# Altium project QUTMS-RADIO-COMPUTE-V00.PrjPcb
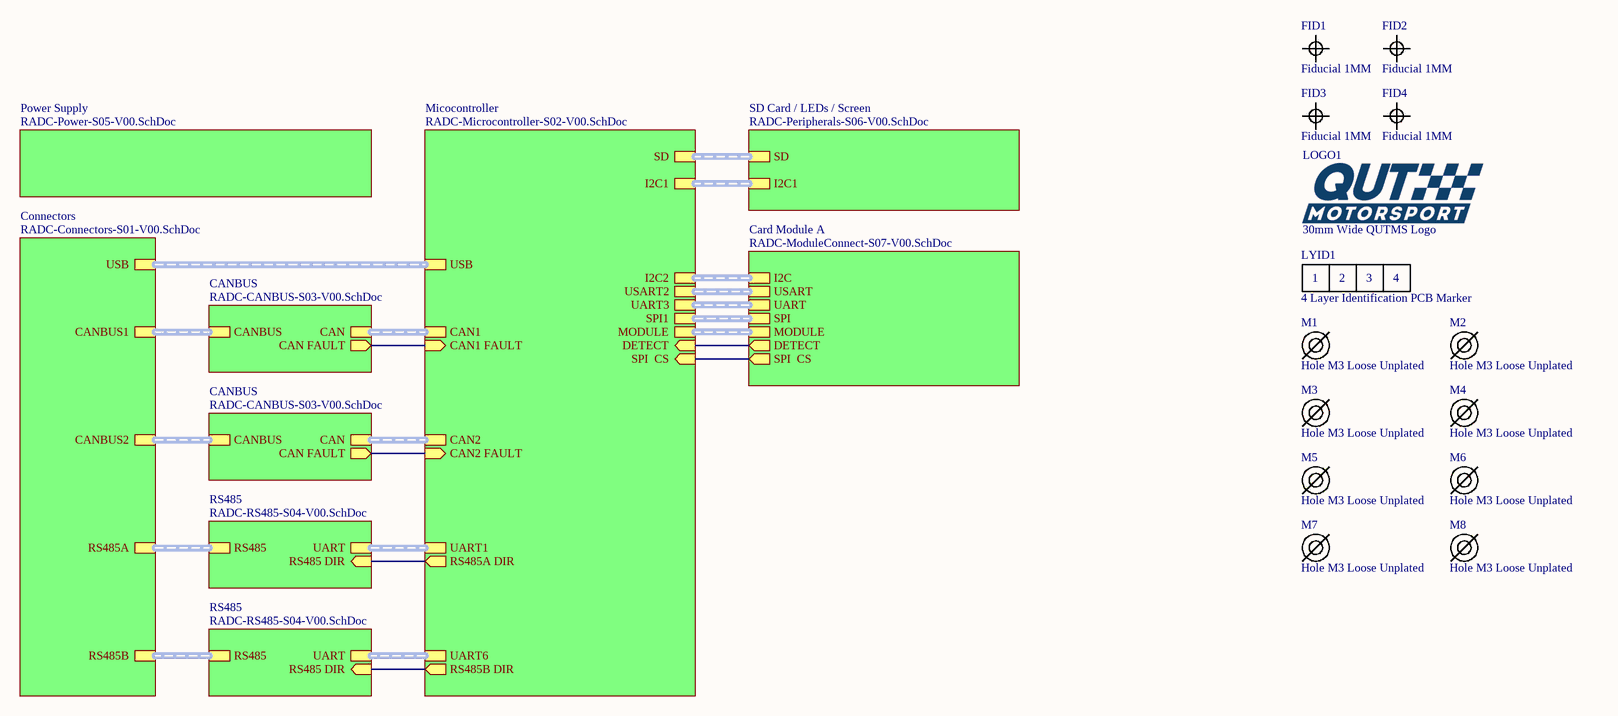
[diagram p0: RADC-Master-S00-V00.SchDoc]
8 sheets, 167 parts. Net scope: hierarchical (ports join the sheet entries above them; power ports are global).
Board file: RADC-B00-V00.PcbDoc
Sheets:
  RADC-Master-S00-V00.SchDoc
    Connectors = RADC-Connectors-S01-V00.SchDoc
    Power Supply = RADC-Power-S05-V00.SchDoc
    Micocontroller = RADC-Microcontroller-S02-V00.SchDoc
    SD Card / LEDs / Screen = RADC-Peripherals-S06-V00.SchDoc
    CANBUS = RADC-CANBUS-S03-V00.SchDoc
    CANBUS = RADC-CANBUS-S03-V00.SchDoc
    Card Module A = RADC-ModuleConnect-S07-V00.SchDoc
    RS485 = RADC-RS485-S04-V00.SchDoc
    RS485 = RADC-RS485-S04-V00.SchDoc

## Sheet RADC-Master-S00-V00.SchDoc: RADC Master (Top Level)
size A3; DrawnBy: Jonn Dillon; DocumentNumber: 1; SheetNumber: 1; SheetTotal: 8; Version: 00; Project: QUTMS RADIO COMPUTE; PageSetup: Record=PageOptions|CenterHorizontal=True|CenterVertical=True|PrintScale=0.97|XCorrection=1.00|YCorrection=1.00|PrintKind=0|BorderSize=5000000|LeftOffset=0|BottomOffset=0|Orientation=2|PaperLength=1000|PaperWidth=1000|Scale=100|PaperSource=7|PrintQuality=-4|MediaType=1|DitherType=10|PaperKind=A4|PrintScaleMode=1

### Parts
FID1  Fiducial 1MM  [FIDUCIAL 1MM]  (no BOM)
FID2  Fiducial 1MM  [FIDUCIAL 1MM]  (no BOM)
FID3  Fiducial 1MM  [FIDUCIAL 1MM]  (no BOM)
FID4  Fiducial 1MM  [FIDUCIAL 1MM]  (no BOM)
LOGO1  30mm Wide QUTMS Logo  [QUTMS LOGO 30MM]  (no BOM)
LYID1  4 Layer Identification PCB Marker  [LAYER IDENT 4]  (no BOM)
M1  Hole M3 Loose Unplated  [M3.5 UNPLATED]  (no BOM)
M2  Hole M3 Loose Unplated  [M3.5 UNPLATED]  (no BOM)
M3  Hole M3 Loose Unplated  [M3.5 UNPLATED]  (no BOM)
M4  Hole M3 Loose Unplated  [M3.5 UNPLATED]  (no BOM)
M5  Hole M3 Loose Unplated  [M3.5 UNPLATED]  (no BOM)
M6  Hole M3 Loose Unplated  [M3.5 UNPLATED]  (no BOM)
M7  Hole M3 Loose Unplated  [M3.5 UNPLATED]  (no BOM)
M8  Hole M3 Loose Unplated  [M3.5 UNPLATED]  (no BOM)

### Sub-sheets
CANBUS = RADC-CANBUS-S03-V00.SchDoc: CAN (harness CAN), CANBUS (harness CANBUS), CAN FAULT (out)
CANBUS = RADC-CANBUS-S03-V00.SchDoc: CAN (harness CAN), CANBUS (harness CANBUS), CAN FAULT (out)
Card Module A = RADC-ModuleConnect-S07-V00.SchDoc: I2C (harness I2C), USART (harness USART), UART (harness UART), SPI (harness SPI), MODULE (harness MODULE), DETECT (out), SPI  CS (out)
Connectors = RADC-Connectors-S01-V00.SchDoc: USB (harness USB), CANBUS2 (harness CANBUS), CANBUS1 (harness CANBUS), RS485A (harness RS485), RS485B (harness RS485)
Micocontroller = RADC-Microcontroller-S02-V00.SchDoc: USB, SD, CAN1, CAN2, I2C2 (harness I2C), USART2 (harness USART), SPI1 (harness SPI), MODULE, UART1, UART3 (harness UART), UART6 (harness UART), DETECT (in), RS485A DIR (out), RS485B DIR (out), SPI  CS (in), CAN1 FAULT (in), CAN2 FAULT (in), I2C1 (harness I2C)
Power Supply = RADC-Power-S05-V00.SchDoc: no entries
RS485 = RADC-RS485-S04-V00.SchDoc: RS485 DIR (in), RS485 (harness RS485), UART (harness UART)
RS485 = RADC-RS485-S04-V00.SchDoc: RS485 DIR (in), RS485 (harness RS485), UART (harness UART)
SD Card / LEDs / Screen = RADC-Peripherals-S06-V00.SchDoc: SD (harness SD), I2C1 (harness I2C)

### Nets
CAN FAULT: sheet Micocontroller/CAN1 FAULT, sheet Micocontroller/CAN2 FAULT, sheet CANBUS/CAN FAULT, sheet CANBUS/CAN FAULT
DETECT: sheet Micocontroller/DETECT, sheet Card Module A/DETECT
RS485A DIR: sheet Micocontroller/RS485A DIR, sheet RS485/RS485 DIR
RS485B DIR: sheet Micocontroller/RS485B DIR, sheet RS485/RS485 DIR
SPI CS: sheet Micocontroller/SPI  CS, sheet Card Module A/SPI  CS

### Buses and harness runs
harness sheet CANBUS/CAN = sheet Micocontroller/CAN1
harness sheet CANBUS/CAN = sheet Micocontroller/CAN2
harness sheet CANBUS/CANBUS = sheet Connectors/CANBUS1
harness sheet CANBUS/CANBUS = sheet Connectors/CANBUS2
harness sheet Card Module A/I2C = sheet Micocontroller/I2C2
harness sheet Card Module A/MODULE = sheet Micocontroller/MODULE
harness sheet Card Module A/SPI = sheet Micocontroller/SPI1
harness sheet Card Module A/UART = sheet Micocontroller/UART3
harness sheet Card Module A/USART = sheet Micocontroller/USART2
harness sheet Connectors/RS485A = sheet RS485/RS485
harness sheet Connectors/RS485B = sheet RS485/RS485
harness sheet Connectors/USB = sheet Micocontroller/USB
harness sheet Micocontroller/I2C1 = sheet SD Card / LEDs / Screen/I2C1
harness sheet Micocontroller/SD = sheet SD Card / LEDs / Screen/SD
harness sheet Micocontroller/UART1 = sheet RS485/UART
harness sheet Micocontroller/UART6 = sheet RS485/UART

### Notes on the sheet
- Revision History:
- Sheet Title:
- Rev
- Date
- Description
- Project:
- Size:
- Drawn By:
- A3
- Number:
- Revision:
- Sheet
- Version:
- of
- QUT Motorsport
- O-120, Gardens Point
- 2 George Street
- Brisbane, QLD 4000
- Australia
- Print Date:
- Print Time:
- File Name:
- (in symbol Layer Identification 4) 1; 2; 3; 4

### Library data of the parts
LOGO1 = QUTMS Logo 30mm
LYID1 = Layer Identification 4
M1-M8 = Hole M3 Loose Unplated: M3.5 Hole, No Plating

## Sheet RADC-Connectors-S01-V00.SchDoc: RADC Connectors (2x MX120G, Dual CANBUS, USB Header)
size A3; DrawnBy: Jonn Dillon; DocumentNumber: 2; SheetNumber: 2; SheetTotal: 8; Version: 00; Project: QUTMS RADIO COMPUTE; PageSetup: Record=PageOptions|CenterHorizontal=True|CenterVertical=True|PrintScale=0.97|XCorrection=1.00|YCorrection=1.00|PrintKind=0|BorderSize=5000000|LeftOffset=0|BottomOffset=0|Orientation=2|PaperLength=1000|PaperWidth=1000|Scale=100|PaperSource=7|PrintQuality=-4|MediaType=1|DitherType=10|PaperKind=A4|PrintScaleMode=1
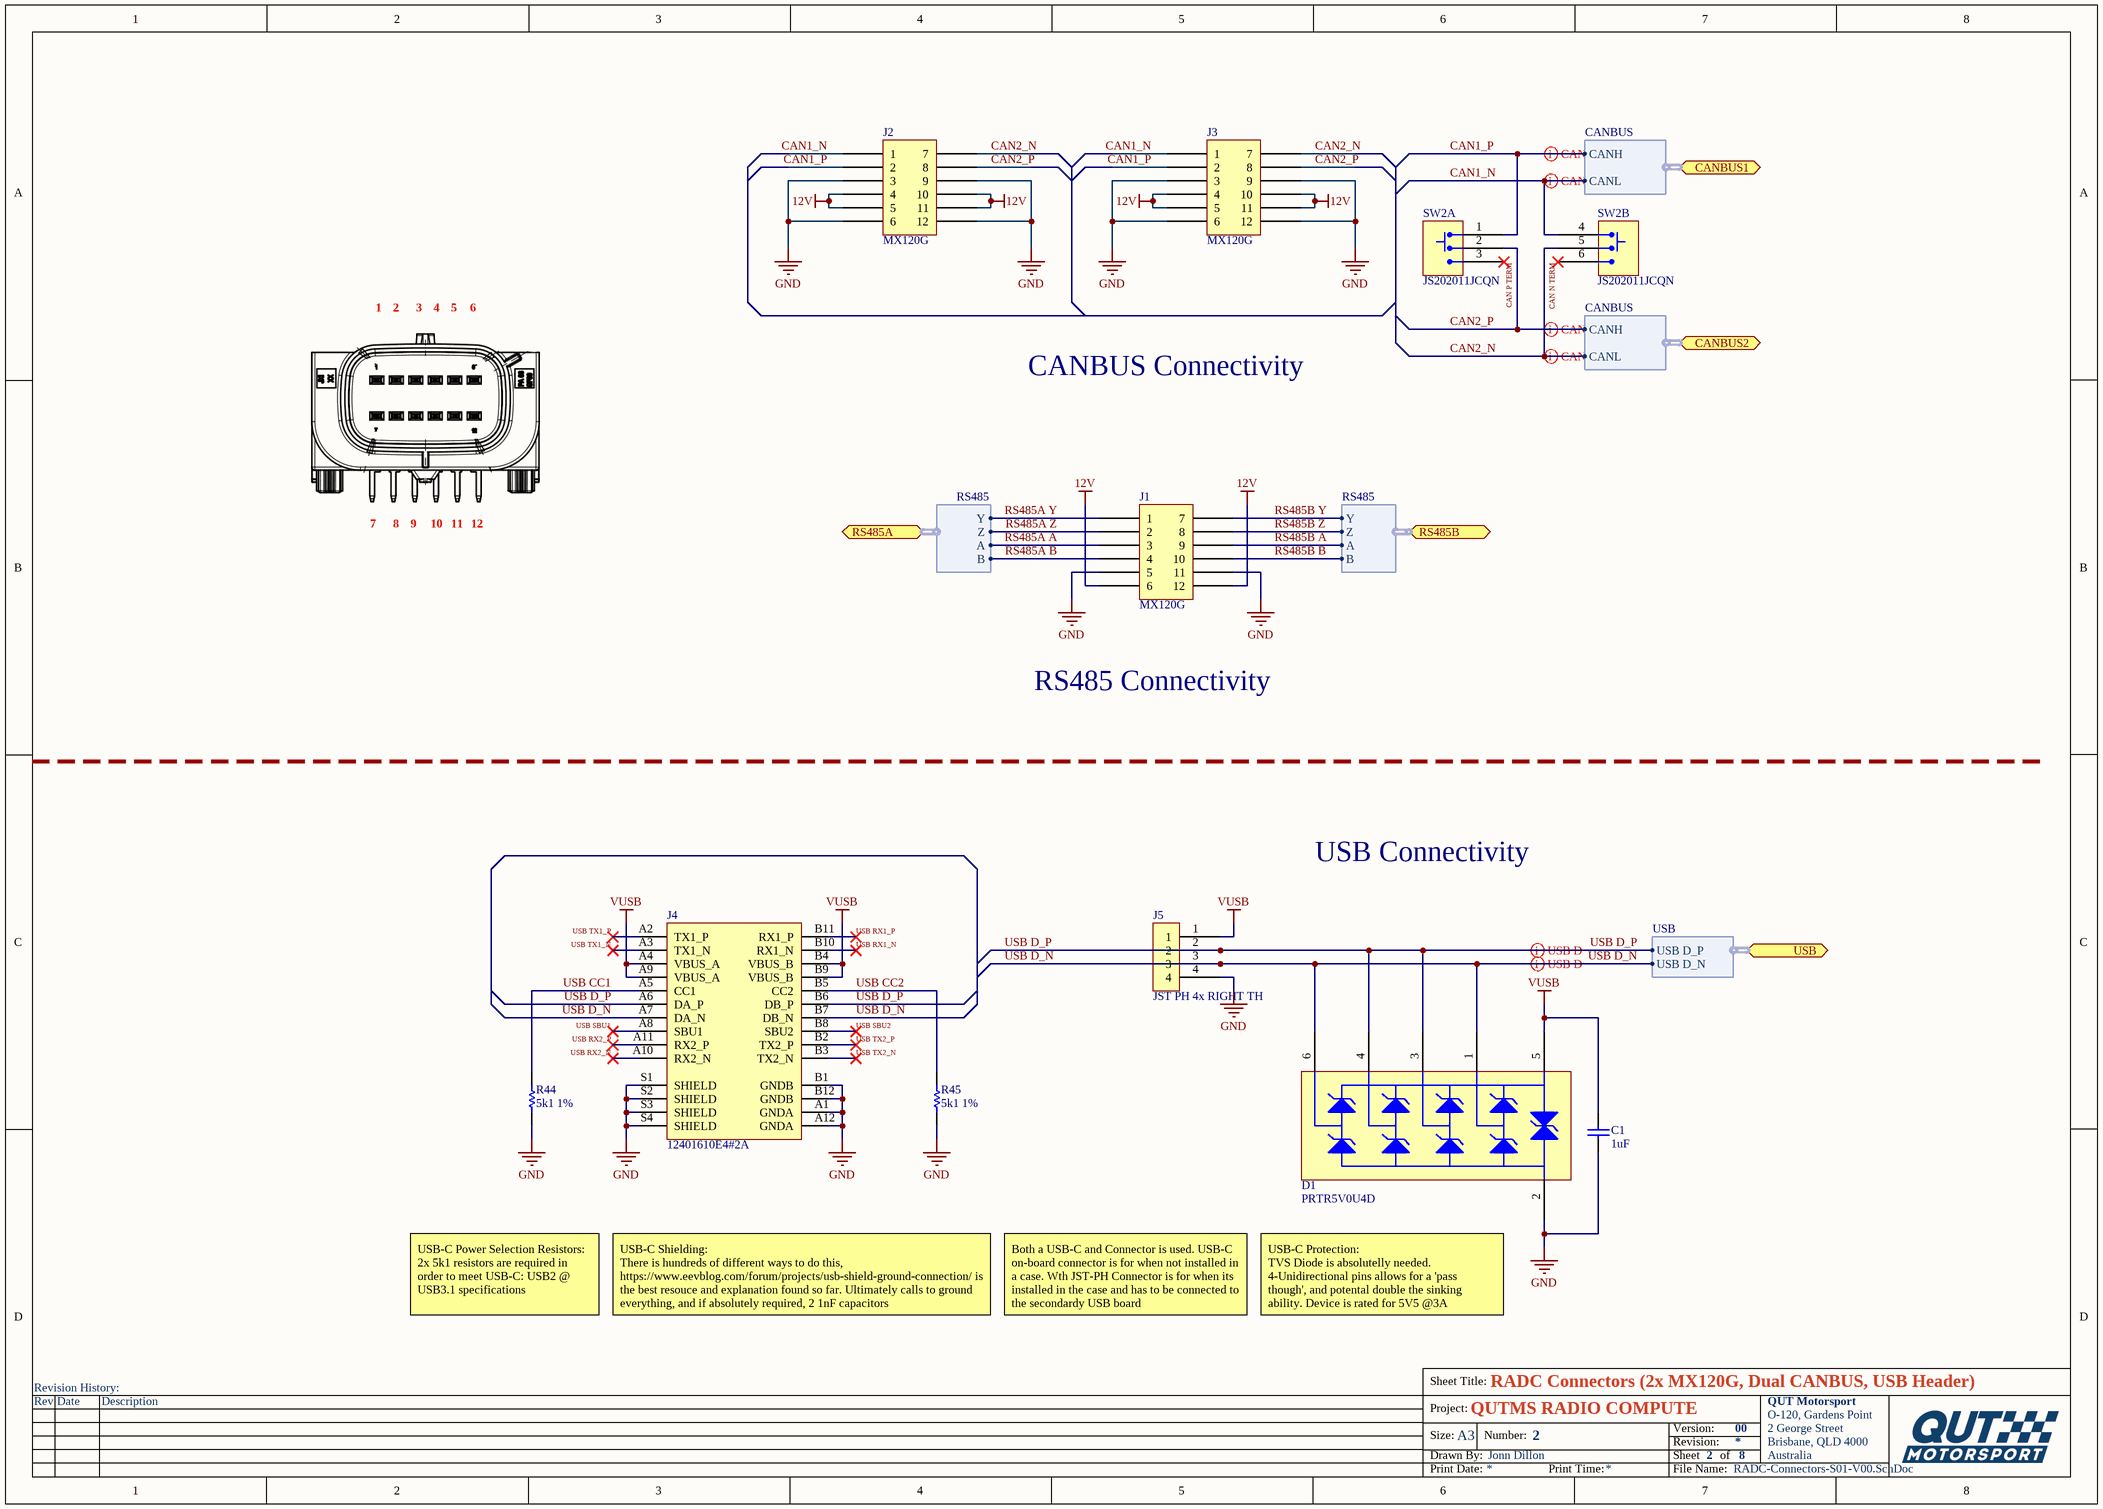
[diagram p1: RADC-Connectors-S01-V00.SchDoc]

### Parts
C1  1uF  [Cap_Ceramic_0603]
D1  PRTR5V0U4D  [SC-47]
J1  MX120G  [MX120G]
J2  MX120G  [MX120G]
J3  MX120G  [MX120G]
J4  12401610E4#2A  [12401610E4#2A]
J5  JST PH 4x RIGHT TH  [JST PH 4x RIGHT TH]
R44  5k1 1%  [Res_ThinFilm_0603]
R45  5k1 1%  [Res_ThinFilm_0603]
SW2  JS202011JCQN  [JS202011JCQN]  (parts A,B of 2)

### Ports
CANBUS1 (bidir, harness CANBUS), CANBUS2 (bidir, harness CANBUS), RS485A (bidir, harness RS485), RS485B (bidir, harness RS485), USB (bidir, harness USB)

### Harnesses
USB: USB D_P, USB D_N
RS485: Y, Z, A, B
CANBUS: CANH, CANL

### Nets
12V: J1.6 J1.12 J2.4 J2.5 J2.10 J2.11 J3.4 J3.5 J3.10 J3.11
GND: C1.1 D1.2(GND) J1.5 J1.11 J2.3 J2.6 J2.9 J2.12 J3.3 J3.6 J3.9 J3.12 J4.A1(GNDA) J4.A12(GNDA) J4.B1(GNDB) J4.B12(GNDB) J4.S1(SHIELD) J4.S2(SHIELD) J4.S3(SHIELD) J4.S4(SHIELD) J5.4 R44.1 R45.1
VUSB: C1.2 D1.5(VCC) J4.A4(VBUS_A) J4.A9(VBUS_A) J4.B4(VBUS_B) J4.B9(VBUS_B) J5.1
CAN1_N: J2.1 J3.1 SW2.4 ; port CANBUS1.CANL
CAN1_P: J2.2 J3.2 SW2.1 ; port CANBUS1.CANH
CAN2_N: J2.7 J3.7 SW2.5 ; port CANBUS2.CANL
CAN2_P: J2.8 J3.8 SW2.2 ; port CANBUS2.CANH
CAN N TERM: SW2.6
CAN P TERM: SW2.3
RS485A A: J1.3 ; port RS485A.A
RS485A B: J1.4 ; port RS485A.B
RS485A Y: J1.1 ; port RS485A.Y
RS485A Z: J1.2 ; port RS485A.Z
RS485B A: J1.9 ; port RS485B.A
RS485B B: J1.10 ; port RS485B.B
RS485B Y: J1.7 ; port RS485B.Y
RS485B Z: J1.8 ; port RS485B.Z
USB CC1: J4.A5(CC1) R44.2
USB CC2: J4.B5(CC2) R45.2
USB D_N: D1.1(P1) D1.6(P4) J4.A7(DA_N) J4.B7(DB_N) J5.3 ; port USB.USB D_N
USB D_P: D1.3(P2) D1.4(P3) J4.A6(DA_P) J4.B6(DB_P) J5.2 ; port USB.USB D_P
USB RX1_N: J4.B10(RX1_N)
USB RX1_P: J4.B11(RX1_P)
USB RX2_N: J4.A10(RX2_N)
USB RX2_P: J4.A11(RX2_P)
USB SBU1: J4.A8(SBU1)
USB SBU2: J4.B8(SBU2)
USB TX1_N: J4.A3(TX1_N)
USB TX1_P: J4.A2(TX1_P)
USB TX2_N: J4.B3(TX2_N)
USB TX2_P: J4.B2(TX2_P)

### Layout directives
differential pair: CAN1_N, CAN1_P, CAN2_N, CAN2_P, USB D_N, USB D_P

### Notes on the sheet
- 1
- 2
- 3
- 4
- 5
- 6
- CANBUS Connectivity
- 7
- 8
- 9
- 10
- 11
- 12
- RS485 Connectivity
- USB Connectivity
- USB-C Power Selection Resistors:
  2x 5k1 resistors are required in order to meet USB-C: USB2 @ USB3.1 specifications
- USB-C Shielding:
  There is hundreds of different ways to do this, https://www.eevblog.com/forum/projects/usb-shield-ground-connection/ is the best resouce and explanation found so far. Ultimately calls to ground everything, and if absolutely required, 2 1nF capacitors
- Both a USB-C and Connector is used. USB-C on-board connector is for when not installed in a case. Wth JST-PH Connector is for when its installed in the case and has to be connected to the secondardy USB board
- USB-C Protection:
  TVS Diode is absolutelly needed. 4-Unidirectional pins allows for a 'pass though', and potental double the sinking ability. Device is rated for 5V5 @3A
- Revision History:
- Sheet Title:
- Rev
- Date
- Description
- Project:
- Size:
- Drawn By:
- A3
- Number:
- Revision:
- Sheet
- Version:
- of
- QUT Motorsport
- O-120, Gardens Point
- 2 George Street
- Brisbane, QLD 4000
- Australia
- Print Date:
- Print Time:
- File Name:

### Library data of the parts
C1 = 1uF 25V 5% X7R 0603: Capacitor, Ceramic, SMD, 1uF, 25V, 5%, X7R, 0603
D1 = PRTR5V0U4D: Clamp Ipp Tvs Diode Surface Mount 6-TSOP
J1-J3 = MX120G: MX120G with standard connector layout
J4 = 12401610E4#2A: USB-C (USB TYPE-C) USB 3.2 Gen 2 (USB 3.1 Gen 2, Superspeed + (USB 3.1)) Receptacle Connector 24 Position Surface Mount, Right Angle; Through Hole
R44 R45 = 5k1 1% 0603: Resistor, SMD, 5k1, 0.1W, 1%, 0603
SW2 = SLIDE DPDT JS202011JCQN

## Sheet RADC-Power-S05-V00.SchDoc: RADC POWER (12V & USB, 12V Protection, 3V3 Out)
size A3; DrawnBy: Jonn Dillon; DocumentNumber: 6; SheetNumber: 6; SheetTotal: 8; Version: 00; Project: QUTMS RADIO COMPUTE; PageSetup: Record=PageOptions|CenterHorizontal=True|CenterVertical=True|PrintScale=0.97|XCorrection=1.00|YCorrection=1.00|PrintKind=0|BorderSize=5000000|LeftOffset=0|BottomOffset=0|Orientation=2|PaperLength=1000|PaperWidth=1000|Scale=100|PaperSource=7|PrintQuality=-4|MediaType=1|DitherType=10|PaperKind=A4|PrintScaleMode=1
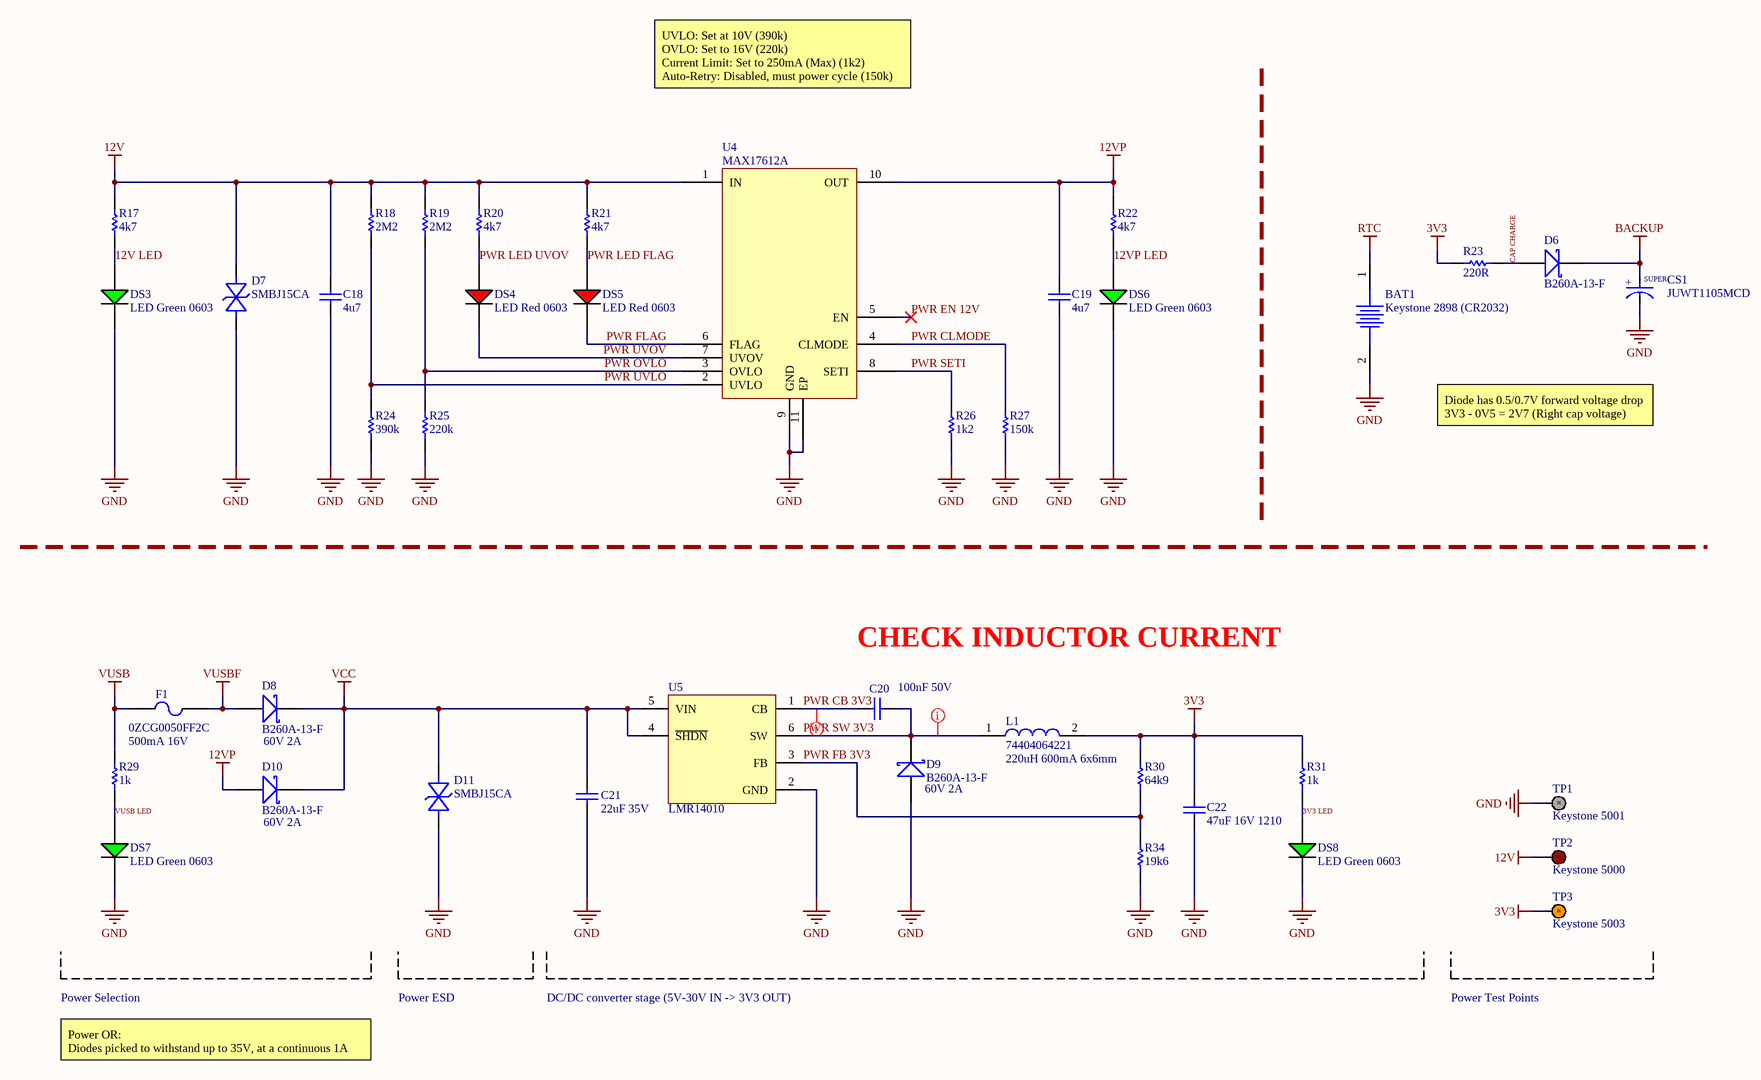
[diagram p2: RADC-Power-S05-V00.SchDoc]

### Parts
BAT1  Keystone 2898 (CR2032)  [Keystone 2898]
C18  4u7  [Cap_Ceramic_0603]
C19  4u7  [Cap_Ceramic_0603]
C20  100nF 50V  [Cap_Ceramic_0603]
C21  22uF 35V  [Cap_Ceramic_1206]
C22  47uF 16V 1210  [Cap_Ceramic_1210]
CS1  JUWT1105MCD  [CAP_ALU_6.3mmD_9mmL]
D6  B260A-13-F  [SMA]
D7  SMBJ15CA  [SMB]
D8  B260A-13-F  [SMA]
D9  B260A-13-F  [SMA]
D10  B260A-13-F  [SMA]
D11  SMBJ15CA  [SMB]
DS3  LED Green 0603  [LED GREEN 0603]
DS4  LED Red 0603  [LED RED 0603]
DS5  LED Red 0603  [LED RED 0603]
DS6  LED Green 0603  [LED GREEN 0603]
DS7  LED Green 0603  [LED GREEN 0603]
DS8  LED Green 0603  [LED GREEN 0603]
F1  0ZCG0050FF2C  [1812 FUSE]
L1  74404064221  [Inductor_6x6mm]
R17  4k7  [Res_ThinFilm_0603]
R18  2M2  [Res_ThinFilm_0603]
R19  2M2  [Res_ThinFilm_0603]
R20  4k7  [Res_ThinFilm_0603]
R21  4k7  [Res_ThinFilm_0603]
R22  4k7  [Res_ThinFilm_0603]
R23  220R  [Res_ThinFilm_0603]
R24  390k  [Res_ThinFilm_0603]
R25  220k  [Res_ThinFilm_0603]
R26  1k2  [Res_ThinFilm_0603]
R27  150k  [Res_ThinFilm_0603]
R29  1k  [Res_ThinFilm_0603]
R30  64k9  [Res_ThinFilm_0603]
R31  1k  [Res_ThinFilm_0603]
R34  19k6  [Res_ThinFilm_0603]
TP1  Keystone 5001  [TestPointHoop_BLACK]
TP2  Keystone 5000  [TestPointHoop_RED]
TP3  Keystone 5003  [TestPointHoop_ORANGE]
U4  MAX17612A  [10-Pin TDFN EP]
U5  LMR14010  [LMR14010]

### Nets
3V3: C22.2 L1.2 R23.1 R30.2 R31.2 TP3.1
12V: C18.2 D7.A(Anode) R17.2 R18.2 R19.2 R20.2 R21.2 TP2.1 U4.1(IN)
12VP: C19.2 D10.A R22.2 U4.10(OUT)
BACKUP: CS1.A D6.K
GND: BAT1.2 C18.1 C19.1 C21.1 C22.1 CS1.K D7.K(Cathode) D9.A D11.K(Cathode) DS3.2(C) DS6.2(C) DS7.2(C) DS8.2(C) R24.1 R25.1 R26.1 R27.1 R34.1 TP1.1 U4.9(GND) U4.11(EP) U5.2(GND)
RTC: BAT1.1
VCC: C21.2 D8.K D10.K D11.A(Anode) U5.4(~{SHDN}) U5.5(VIN)
VUSB: F1.1 R29.2
VUSBF: D8.A F1.2
3V3 LED: DS8.1(A) R31.1
12V LED: DS3.1(A) R17.1
12VP LED: DS6.1(A) R22.1
CAP CHARGE: D6.A R23.2
PWR CB 3V3: C20.1 U5.1(CB)
PWR CLMODE: R27.2 U4.4(CLMODE)
PWR EN 12V: U4.5(EN)
PWR FB 3V3: R30.1 R34.2 U5.3(FB)
PWR FLAG: DS5.2(C) U4.6(FLAG)
PWR LED FLAG: DS5.1(A) R21.1
PWR LED UVOV: DS4.1(A) R20.1
PWR OVLO: R19.1 R25.2 U4.3(OVLO)
PWR SETI: R26.2 U4.8(SETI)
PWR SW 3V3: C20.2 D9.K L1.1 U5.6(SW)
PWR UVLO: R18.1 R24.2 U4.2(UVLO)
PWR UVOV: DS4.2(C) U4.7(UVOV)
VUSB LED: DS7.1(A) R29.1

### Layout directives
net class PWESUPPLY: PWR CB 3V3, PWR SW 3V3

### Notes on the sheet
- UVLO: Set at 10V (390k)
  OVLO: Set to 16V (220k)
  Current Limit: Set to 250mA (Max) (1k2)
  Auto-Retry: Disabled, must power cycle (150k)
- Diode has 0.5/0.7V forward voltage drop
  3V3 - 0V5 = 2V7 (Right cap voltage)
- CHECK INDUCTOR CURRENT
- 500mA 16V
- 60V 2A
- (near D9) 60V 2A
- (near L1) 220uH 600mA 6x6mm
- (near D10) 60V 2A
- Power Selection
- Power OR:
  Diodes picked to withstand up to 35V, at a continuous 1A
- Power ESD
- DC/DC converter stage (5V-30V IN -> 3V3 OUT)
- Power Test Points
- Revision History:
- Sheet Title:
- Rev
- Date
- Description
- Project:
- Size:
- Drawn By:
- A3
- Number:
- Revision:
- Sheet
- Version:
- of
- QUT Motorsport
- O-120, Gardens Point
- 2 George Street
- Brisbane, QLD 4000
- Australia
- Print Date:
- Print Time:
- File Name:
- (in symbol JUWT1105MCD) +; SUPER
- (in symbol TestPoint_Hoop_Black) H
- (in symbol TestPoint_Hoop_Orange) H
- (in symbol TestPoint_Hoop_Red) H

### Library data of the parts
BAT1 = Keystone 2898: Battery Retainer Coin, 20.0mm 1 Cell SMD (SMT) Tab
C18 C19 = 4u7 50V 5% X7R 0603: Capacitor, Ceramic, SMD, 4u7, 50V, 5%, X7R, 0603
C20 = 100nF 50V 5% X7R 0603: Capacitor, Ceramic, SMD, 100nF, 50V, 5%, X7R, 0603
C21 = 22uF 35V 20% X5R 1206: 22µF ±20% 35V Ceramic Capacitor X5R 1206 (3216 Metric); ComponentLink1Description: Digikey; ComponentLink1URL: https://www.digikey.com.au/product-detail/en/tdk-corporation/C3216X5R1V226M160AC/445-8045-1-ND/2792165; ComponentLink2Description: Datasheet; ComponentLink2URL: https://product.tdk.com/info/en/catalog/datasheets/mlcc_commercial_general_en.pdf
C22 = 47uF 16V 10% X7R 1210: Capacitor, Ceramic, SMD, 47uF, 16V, 5%, X7R, 1210
CS1 = JUWT1105MCD: 1F (EDLC) Supercapacitor 2.7V Radial, Can 4Ohm @ 1kHz 1000 Hrs @ 70°C
D6 D8-D10 = B260A-13-F: Diode, Schottky Barrier Rectifier, 60 V, 2 A, B260A-13-F
D7 D11 = SMBJ15CA: Diode, SMD, TVS Diode, 15V 24.4V, DO214AA/SMB; ComponentLink1Description: Digikey; ComponentLink1URL: https://www.digikey.com.au/product-detail/en/littelfuse-inc/SMBJ15CA/SMBJ15CALFCT-ND/285983; ComponentLink2Description: Datasheet; ComponentLink2URL: https://www.littelfuse.com/~/media/electronics/datasheets/tvs_diodes/littelfuse_tvs_diode_smbj_datasheet.pdf.pdf
F1 = 0ZCG0050FF2C: Polymeric PTC Resettable Fuse 16V 500mA Ih Surface Mount 1812 (4532 Metric), Concave
L1 = 74404064221: FIXED IND 220UH 660MA 850 MOHM; ComponentLink1Description: Digikey; ComponentLink1URL: https://www.digikey.com.au/product-detail/en/w%C3%BCrth-elektronik/74404064221/732-7261-1-ND/5353241; ComponentLink2Description: LCSC A; ComponentLink2URL: https://lcsc.com/product-detail/Power-Inductors_Sunlord-SWPA6045S221MT_C91047.html; ComponentLink3Description: LCSC B; ComponentLink3URL: https://lcsc.com/product-detail/Power-Inductors_SXN-Shun-Xiang-Nuo-Elec-SMNR6045-221MT_C467145.html
R17 R20-R22 = 4k7 5% 0603: Resistor, SMD, 4k7, 0.1W, 5%, 0603
R18 R19 = 2M2 5% 0603: Resistor, SMD, 2M2, 0.1W, 5%, 0603
R23 = 220R 5% 0603: Resistor, SMD, 220R, 0.1W, 5%, 0603
R24 = 390k 5% 0603: Resistor, SMD, 390k, 0.1W, 5%, 0603
R25 = 220k 5% 0603: Resistor, SMD, 220k, 0.1W, 5%, 0603
R26 = 1k2 5% 0603: Resistor, SMD, 1k2, 0.1W, 5%, 0603
R27 = 150k 5%, 0603: Resistor, SMD, 150k, 0.1W, 5%, 0603
R29 R31 = 1k 5% 0603: Resistor, SMD, 1k, 0.1W, 5%, 0603
R30 = 64k9 1% 0603: Resistor, SMD, 64k9, 0.1W, 5%, 0603
R34 = 19k6 1% 0603: Resistor, SMD, 19k6, 0.1W, 5%, 0603
TP1 = TestPoint_Hoop_Black
TP2 = TestPoint_Hoop_Red
TP3 = TestPoint_Hoop_Orange
U4 = MAX17612A: Overvoltage, Undervoltage Protection PMIC 10-TDFN-EP (3x3)

## Sheet RADC-Microcontroller-S02-V00.SchDoc: RADC Microcontroller (STM32F446ZC, 144LQFP)
size A3; DrawnBy: Jonn Dillon; DocumentNumber: 3; SheetNumber: 3; SheetTotal: 8; Version: 00; Project: QUTMS RADIO COMPUTE; PageSetup: Record=PageOptions|CenterHorizontal=True|CenterVertical=True|PrintScale=0.97|XCorrection=1.00|YCorrection=1.00|PrintKind=0|BorderSize=5000000|LeftOffset=0|BottomOffset=0|Orientation=2|PaperLength=1000|PaperWidth=1000|Scale=100|PaperSource=7|PrintQuality=-4|MediaType=1|DitherType=10|PaperKind=A4|PrintScaleMode=1
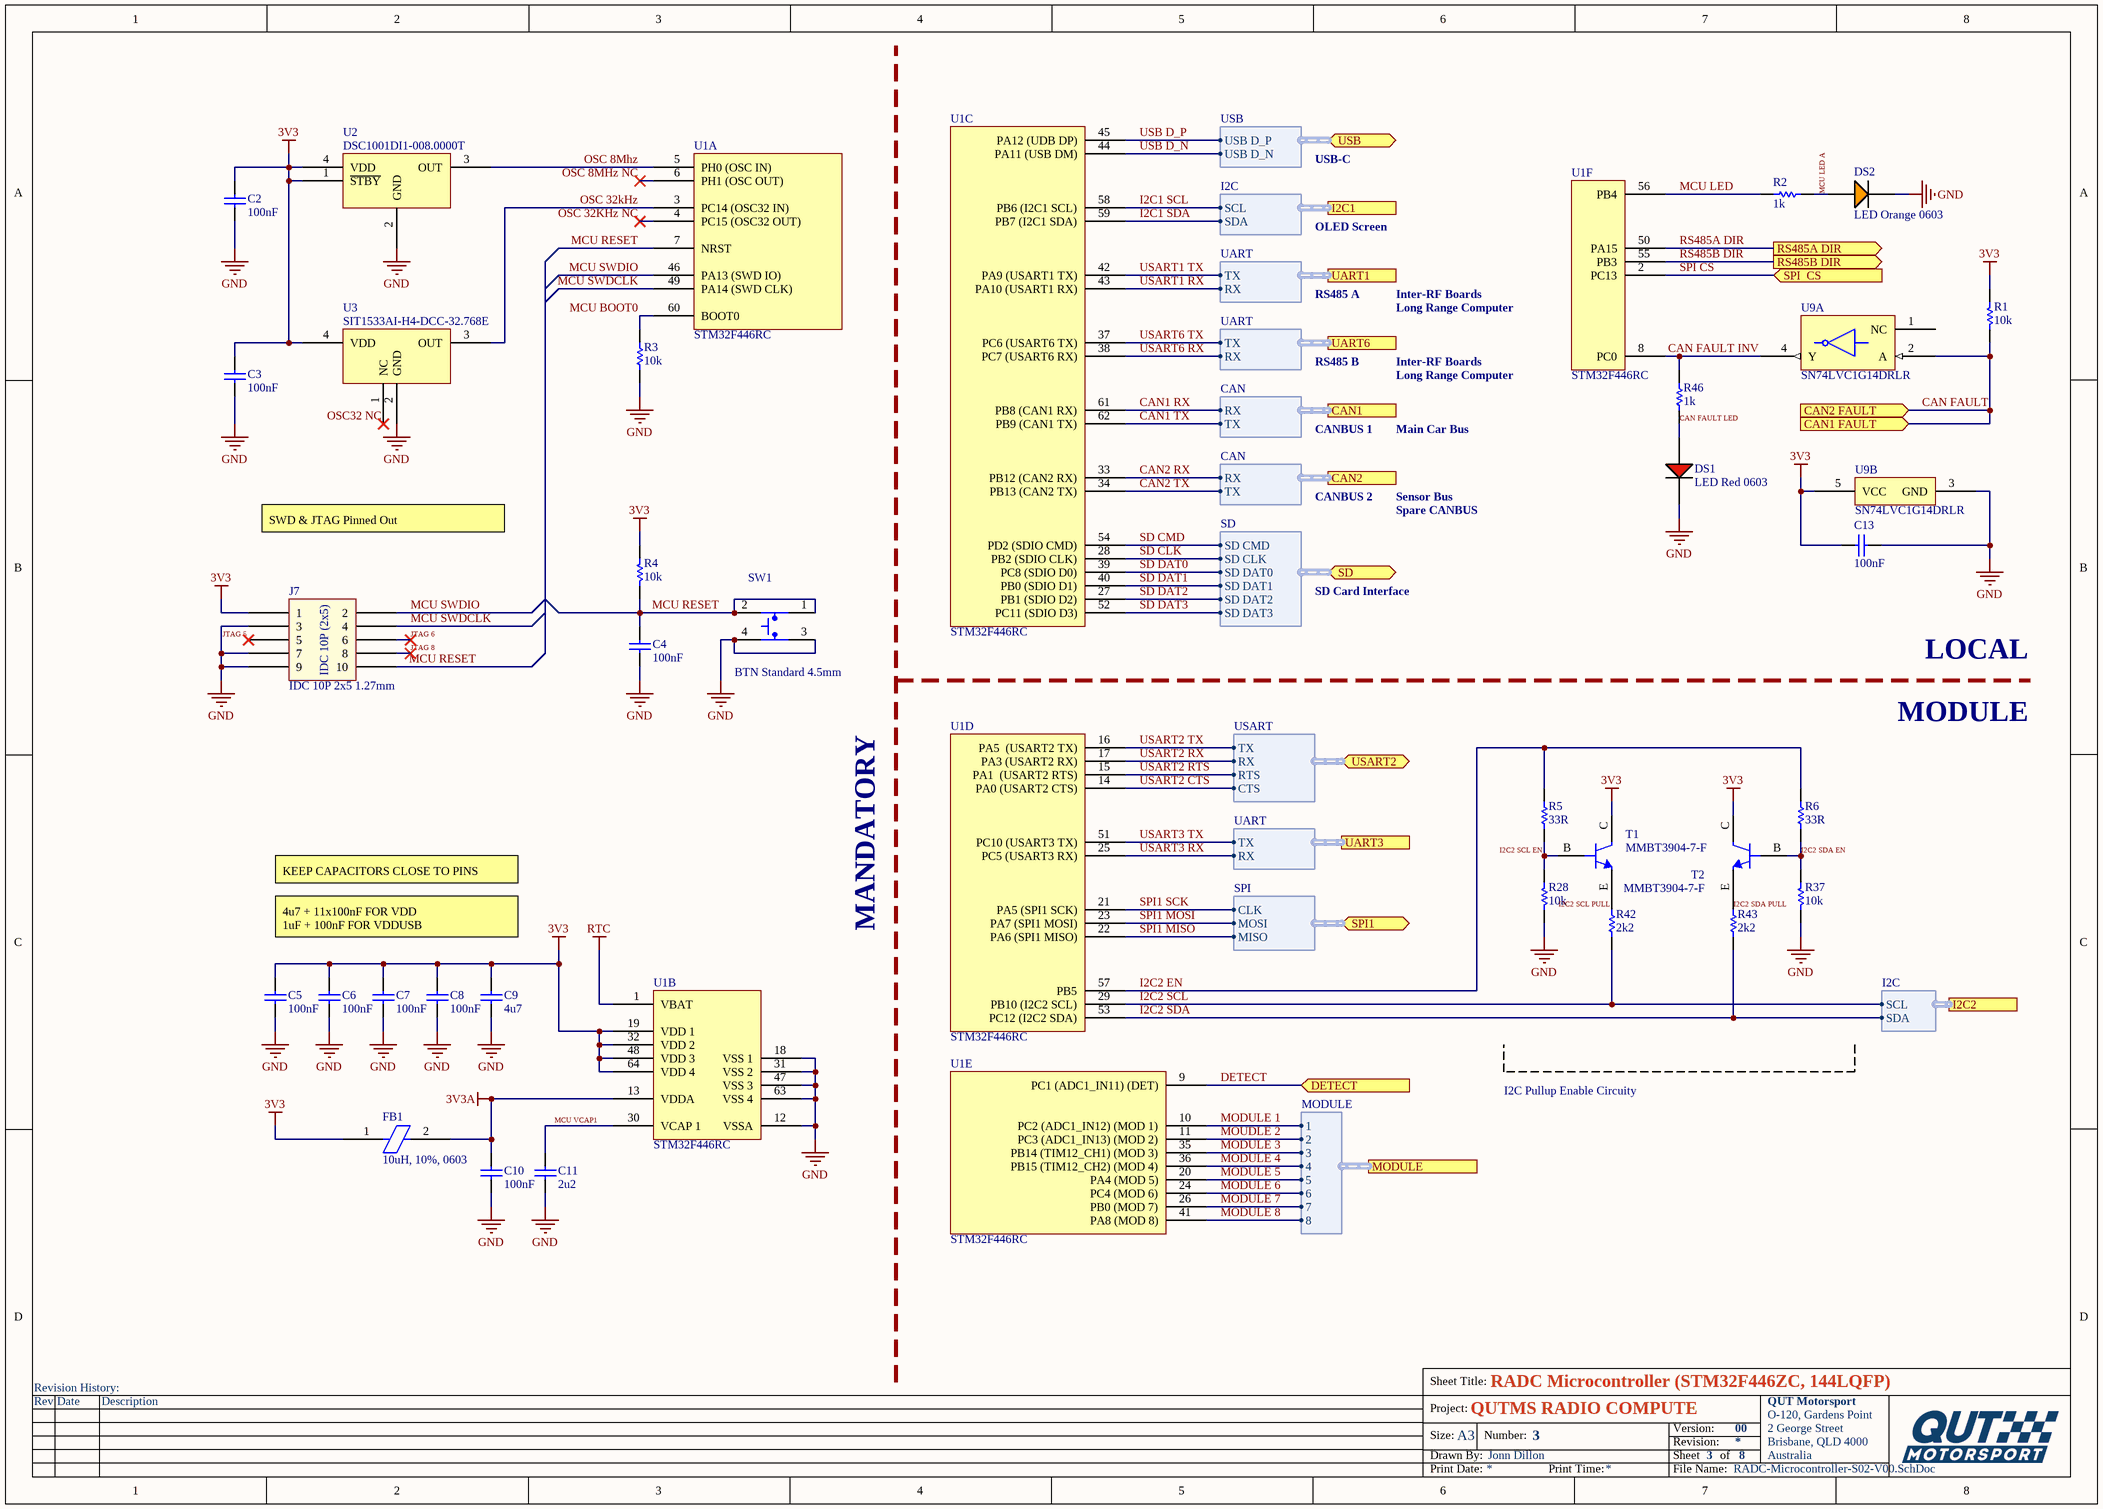
[diagram p3: RADC-Microcontroller-S02-V00.SchDoc]

### Parts
C2  100nF  [Cap_Ceramic_0603]
C3  100nF  [Cap_Ceramic_0603]
C4  100nF  [Cap_Ceramic_0603]
C5  100nF  [Cap_Ceramic_0603]
C6  100nF  [Cap_Ceramic_0603]
C7  100nF  [Cap_Ceramic_0603]
C8  100nF  [Cap_Ceramic_0603]
C9  4u7  [Cap_Ceramic_0603]
C10  100nF  [Cap_Ceramic_0603]
C11  2u2  [Cap_Ceramic_0603]
C13  100nF  [Cap_Ceramic_0603]
DS1  LED Red 0603  [LED RED 0603]
DS2  LED Orange 0603  [LED ORANGE 0603]
FB1  10uH, 10%, 0603  [Inductor_0603]
J7  IDC 10P 2x5 1.27mm  [IDC 1.27MM 10P]
R1  10k  [Res_ThinFilm_0603]
R2  1k  [Res_ThinFilm_0603]
R3  10k  [Res_ThinFilm_0603]
R4  10k  [Res_ThinFilm_0603]
R5  33R  [Res_ThinFilm_0603]
R6  33R  [Res_ThinFilm_0603]
R28  10k  [Res_ThinFilm_0603]
R37  10k  [Res_ThinFilm_0603]
R42  2k2  [Res_ThinFilm_0603]
R43  2k2  [Res_ThinFilm_0603]
R46  1k  [Res_ThinFilm_0603]
SW1  BTN Standard 4.5mm  [BTN STANDARD 4.5mm X 4.5mm]
T1  MMBT3904-7-F  [SOT23-3 - Transistor]
T2  MMBT3904-7-F  [SOT23-3 - Transistor]
U1  STM32F446RC  [STM-LQFP64_V]  (parts A,B,C,D,E,F of 6)
U2  DSC1001DI1-008.0000T  [DSC1001DI1-008.0000TCT-ND]
U3  SIT1533AI-H4-DCC-32.768E  [SIT1533AI-H4-DCC-32.768E]
U9  SN74LVC1G14DRLR  [SOT-553]  (parts A,B of 2)

### Ports
CAN1 (harness CAN), CAN1 FAULT (in), CAN2 (harness CAN), CAN2 FAULT (in), DETECT (in), I2C1 (harness I2C), I2C2 (harness I2C), MODULE (harness MODULE), RS485A DIR (out), RS485B DIR (out), SD (bidir, harness SD), SPI1 (bidir, harness SPI), SPI  CS (in), UART1 (harness UART), UART3 (harness UART), UART6 (harness UART), USART2 (bidir, harness USART), USB (bidir, harness USB)

### Harnesses
USB: USB D_P, USB D_N
CAN: RX, TX
SD: SD DAT2, SD DAT3, SD CMD, SD CLK, SD DAT0, SD DAT1
SPI: MISO, MOSI, CLK
UART: TX, RX
USART: TX, RX, RTS, CTS
I2C: SDA, SCL
MODULE: 1, 2, 3, 4, 5, 6, 7, 8

### Nets
3V3: C2.2 C3.2 C5.2 C6.2 C7.2 C8.2 C9.2 C13.2 FB1.1 J7.1 R1.2 R4.2 T1.C T2.C U1.19(VDD_1) U1.32(VDD_2) U1.48(VDD_3) U1.64(VDD_4) U2.1(~{STBY}) U2.4(VDD) U3.4(VDD) U9.5(VCC)
3V3A: C10.2 FB1.2 U1.13(VDDA)
GND: C2.1 C3.1 C4.1 C5.1 C6.1 C7.1 C8.1 C9.1 C10.1 C11.1 C13.1 DS1.2(C) DS2.2(C) J7.3 J7.7 J7.9 R3.1 R28.1 R37.1 SW1.3 SW1.4 U1.12(VSSA) U1.18(VSS_1) U1.31(VSS_2) U1.47(VSS_3) U1.63(VSS_4) U2.2(GND) U3.2(GND) U9.3(GND)
RTC: U1.1(VBAT)
CAN1 RX: U1.61(PB8_(CAN1_RX)) ; port CAN1.RX  [project net CAN RX]
CAN1 TX: U1.62(PB9_(CAN1_TX)) ; port CAN1.TX  [project net CAN TX]
CAN2 RX: U1.33(PB12_(CAN2_RX)) ; port CAN2.RX  [project net CAN RX]
CAN2 TX: U1.34(PB13_(CAN2_TX)) ; port CAN2.TX  [project net CAN TX]
CAN FAULT: R1.1 U9.2(A) ; port CAN1 FAULT, port CAN2 FAULT
CAN FAULT INV: R46.2 U1.8(PC0) U9.4(Y)
CAN FAULT LED: DS1.1(A) R46.1
DETECT: U1.9(PC1_(ADC1_IN11)_(DET)) ; port DETECT
I2C1 SCL: U1.58(PB6_(I2C1_SCL)) ; port I2C1.SCL
I2C1 SDA: U1.59(PB7_(I2C1_SDA)) ; port I2C1.SDA
I2C2 EN: R5.2 R6.2 U1.57(PB5)
I2C2 SCL: R42.1 U1.29(PB10_(I2C2_SCL)) ; port I2C2.SCL
I2C2 SCL EN: R5.1 R28.2 T1.B
I2C2 SDA: R43.1 U1.53(PC12_(I2C2_SDA)) ; port I2C2.SDA
I2C2 SDA EN: R6.1 R37.2 T2.B
JTAG 5: J7.5
JTAG 6: J7.6
JTAG 8: J7.8
MCU BOOT0: R3.2 U1.60(BOOT0)
MCU LED: R2.2 U1.56(PB4)
MCU LED A: DS2.1(A) R2.1
MCU RESET: C4.2 J7.10 R4.1 SW1.1 SW1.2 U1.7(NRST)
MCU SWDCLK: J7.4 U1.49(PA14_(SWD_CLK))
MCU SWDIO: J7.2 U1.46(PA13_(SWD_IO))
MCU VCAP1: C11.2 U1.30(VCAP_1)
MODULE 1: U1.10(PC2_(ADC1_IN12)_(MOD_1)) ; port MODULE.1
MODULE 3: U1.35(PB14_(TIM12_CH1)_(MOD_3)) ; port MODULE.3
MODULE 4: U1.36(PB15_(TIM12_CH2)_(MOD_4)) ; port MODULE.4
MODULE 5: U1.20(PA4_(MOD_5)) ; port MODULE.5
MODULE 6: U1.24(PC4_(MOD_6)) ; port MODULE.6
MODULE 7: U1.26(PB0_(MOD_7)) ; port MODULE.7
MODULE 8: U1.41(PA8_(MOD_8)) ; port MODULE.8
MOUDLE 2: U1.11(PC3_(ADC1_IN13)_(MOD_2)) ; port MODULE.2
OSC32 NC: U3.1(NC)
OSC 8Mhz: U1.5(PH0_(OSC_IN)) U2.3(OUT)
OSC 8MHz NC: U1.6(PH1_(OSC_OUT))
OSC 32kHz: U1.3(PC14_(OSC32_IN)) U3.3(OUT)
OSC 32KHz NC: U1.4(PC15_(OSC32_OUT))
RS485A DIR: U1.50(PA15) ; port RS485A DIR
RS485B DIR: U1.55(PB3) ; port RS485B DIR
SD CLK: U1.28(PB2_(SDIO_CLK)) ; port SD.SD CLK
SD CMD: U1.54(PD2_(SDIO_CMD)) ; port SD.SD CMD
SD DAT0: U1.39(PC8_(SDIO_D0)) ; port SD.SD DAT0
SD DAT1: U1.40(PB0_(SDIO_D1)) ; port SD.SD DAT1
SD DAT2: U1.27(PB1_(SDIO_D2)) ; port SD.SD DAT2
SD DAT3: U1.52(PC11_(SDIO_D3)) ; port SD.SD DAT3
SPI1 MISO: U1.22(PA6_(SPI1_MISO)) ; port SPI1.MISO
SPI1 MOSI: U1.23(PA7_(SPI1_MOSI)) ; port SPI1.MOSI
SPI1 SCK: U1.21(PA5_(SPI1_SCK)) ; port SPI1.CLK
SPI CS: U1.2(PC13) ; port SPI  CS
USART1 RX: U1.43(PA10_(USART1_RX)) ; port UART1.RX
USART1 TX: U1.42(PA9_(USART1_TX)) ; port UART1.TX
USART2 CTS: U1.14(PA0_(USART2_CTS)) ; port USART2.CTS
USART2 RTS: U1.15(PA1__(USART2_RTS)) ; port USART2.RTS
USART2 RX: U1.17(PA3_(USART2_RX)) ; port USART2.RX
USART2 TX: U1.16(PA5__(USART2_TX)) ; port USART2.TX
USART3 RX: U1.25(PC5_(USART3_RX)) ; port UART3.RX
USART3 TX: U1.51(PC10_(USART3_TX)) ; port UART3.TX
USART6 RX: U1.38(PC7_(USART6_RX)) ; port UART6.RX
USART6 TX: U1.37(PC6_(USART6_TX)) ; port UART6.TX
USB D_N: U1.44(PA11_(USB_DM)) ; port USB.USB D_N
USB D_P: U1.45(PA12_(UDB_DP)) ; port USB.USB D_P
NetR42_2: R42.2 T1.E
NetR43_2: R43.2 T2.E

Not connected (* = marked no-connect by the designer): U9 1(NC)

### Notes on the sheet
- USB-C
- OLED Screen
- RS485 A
- Inter-RF Boards
- Long Range Computer
- RS485 B
- CANBUS 1
- Main Car Bus
- CANBUS 2
- Sensor Bus
- Spare CANBUS
- SWD & JTAG Pinned Out
- SD Card Interface
- LOCAL
- MODULE
- MANDATORY
- KEEP CAPACITORS CLOSE TO PINS
- 4u7 + 11x100nF FOR VDD
  1uF + 100nF FOR VDDUSB
- I2C Pullup Enable Circuity
- Labels drawn without touching a wire or pin: I2C2 SCL PULL, I2C2 SDA PULL
- Revision History:
- Sheet Title:
- Rev
- Date
- Description
- Project:
- Size:
- Drawn By:
- A3
- Number:
- Revision:
- Sheet
- Version:
- of
- QUT Motorsport
- O-120, Gardens Point
- 2 George Street
- Brisbane, QLD 4000
- Australia
- Print Date:
- Print Time:
- File Name:
- (in symbol IDC 10P 2x5 1.27mm) IDC 10P (2x5)

### Library data of the parts
C2-C8 C10 C13 = 100nF 50V 5% X7R 0603: as C20 on sheet RADC-Power-S05-V00
C9 = 4u7 50V 5% X7R 0603: as C18 on sheet RADC-Power-S05-V00
C11 = 2u2 50V 5% X7R 0603: Capacitor, Ceramic, SMD, 2u2, 50V, 5%, X7R, 0603
R1 R3 R4 R28 R37 = 10k 5% 0603: Resistor, SMD, 10k, 0.1W, 5%, 0603
R2 R46 = 1k 5% 0603: Resistor, SMD, 1k, 0.1W, 5%, 0603
R5 R6 = 33R 5% 0603: Resistor, SMD, 33R, 0.1W, 5%, 0603
R42 R43 = 2k2 5% 0603: Resistor, SMD, 2k2, 0.1W, 5%, 0603
SW1 = BTN Standard 4.5mm: Standard 4.5mm X 4.5mm momentary button; ComponentLink1Description: LCSC; ComponentLink1URL: https://lcsc.com/product-detail/Tactile-Switches_BRIGHT-TSA063G50-250_C294565.html
T1 T2 = MMBT3904-7-F: Bipolar (BJT) Transistor NPN 40V 200mA 300MHz 300mW Surface Mount SOT-23-3
U1 = STM32F446RC: ARM® Cortex®-M4 STM32F4 Microcontroller IC 32-Bit 180MHz 256KB (256K x 8) FLASH 64-LQFP (10x10)
U2 = DSC1001DI1-008.0000T: 8MHz XO (Standard) CMOS Oscillator 1.8 ~ 3.3V Standby (Power Down) 4-SMD, No Lead
U3 = SIT1533AI-H4-DCC-32.768E: 32.768kHz XO (Standard) LVCMOS Oscillator 1.5V ~ 3.63V 4-SMD, No Lead
U9 = SN74LVC1G14DRLR: Inverter IC 1 Channel Schmitt Trigger SOT-5
FB1 = 10uH, 10%, 0603: ComponentLink1Description: Digikey; ComponentLink1URL: https://www.digikey.com.au/product-detail/en/w%C3%BCrth-elektronik/74404064221/732-7261-1-ND/5353241; ComponentLink2Description: LCSC A; ComponentLink2URL: https://lcsc.com/product-detail/Power-Inductors_Sunlord-SWPA6045S221MT_C91047.html; ComponentLink3Description: LCSC B; ComponentLink3URL: https://lcsc.com/product-detail/Power-Inductors_SXN-Shun-Xiang-Nuo-Elec-SMNR6045-221MT_C467145.html

## Sheet RADC-Peripherals-S06-V00.SchDoc: RADC Peripherals (SD Card, I2C / OLED Header, USART Header)
size A3; DrawnBy: Jonn Dillon; DocumentNumber: 5; SheetNumber: 5; SheetTotal: 8; Version: 00; Project: QUTMS RADIO COMPUTE; PageSetup: Record=PageOptions|CenterHorizontal=True|CenterVertical=True|PrintScale=0.97|XCorrection=1.00|YCorrection=1.00|PrintKind=0|BorderSize=5000000|LeftOffset=0|BottomOffset=0|Orientation=2|PaperLength=1000|PaperWidth=1000|Scale=100|PaperSource=7|PrintQuality=-4|MediaType=1|DitherType=10|PaperKind=A4|PrintScaleMode=1
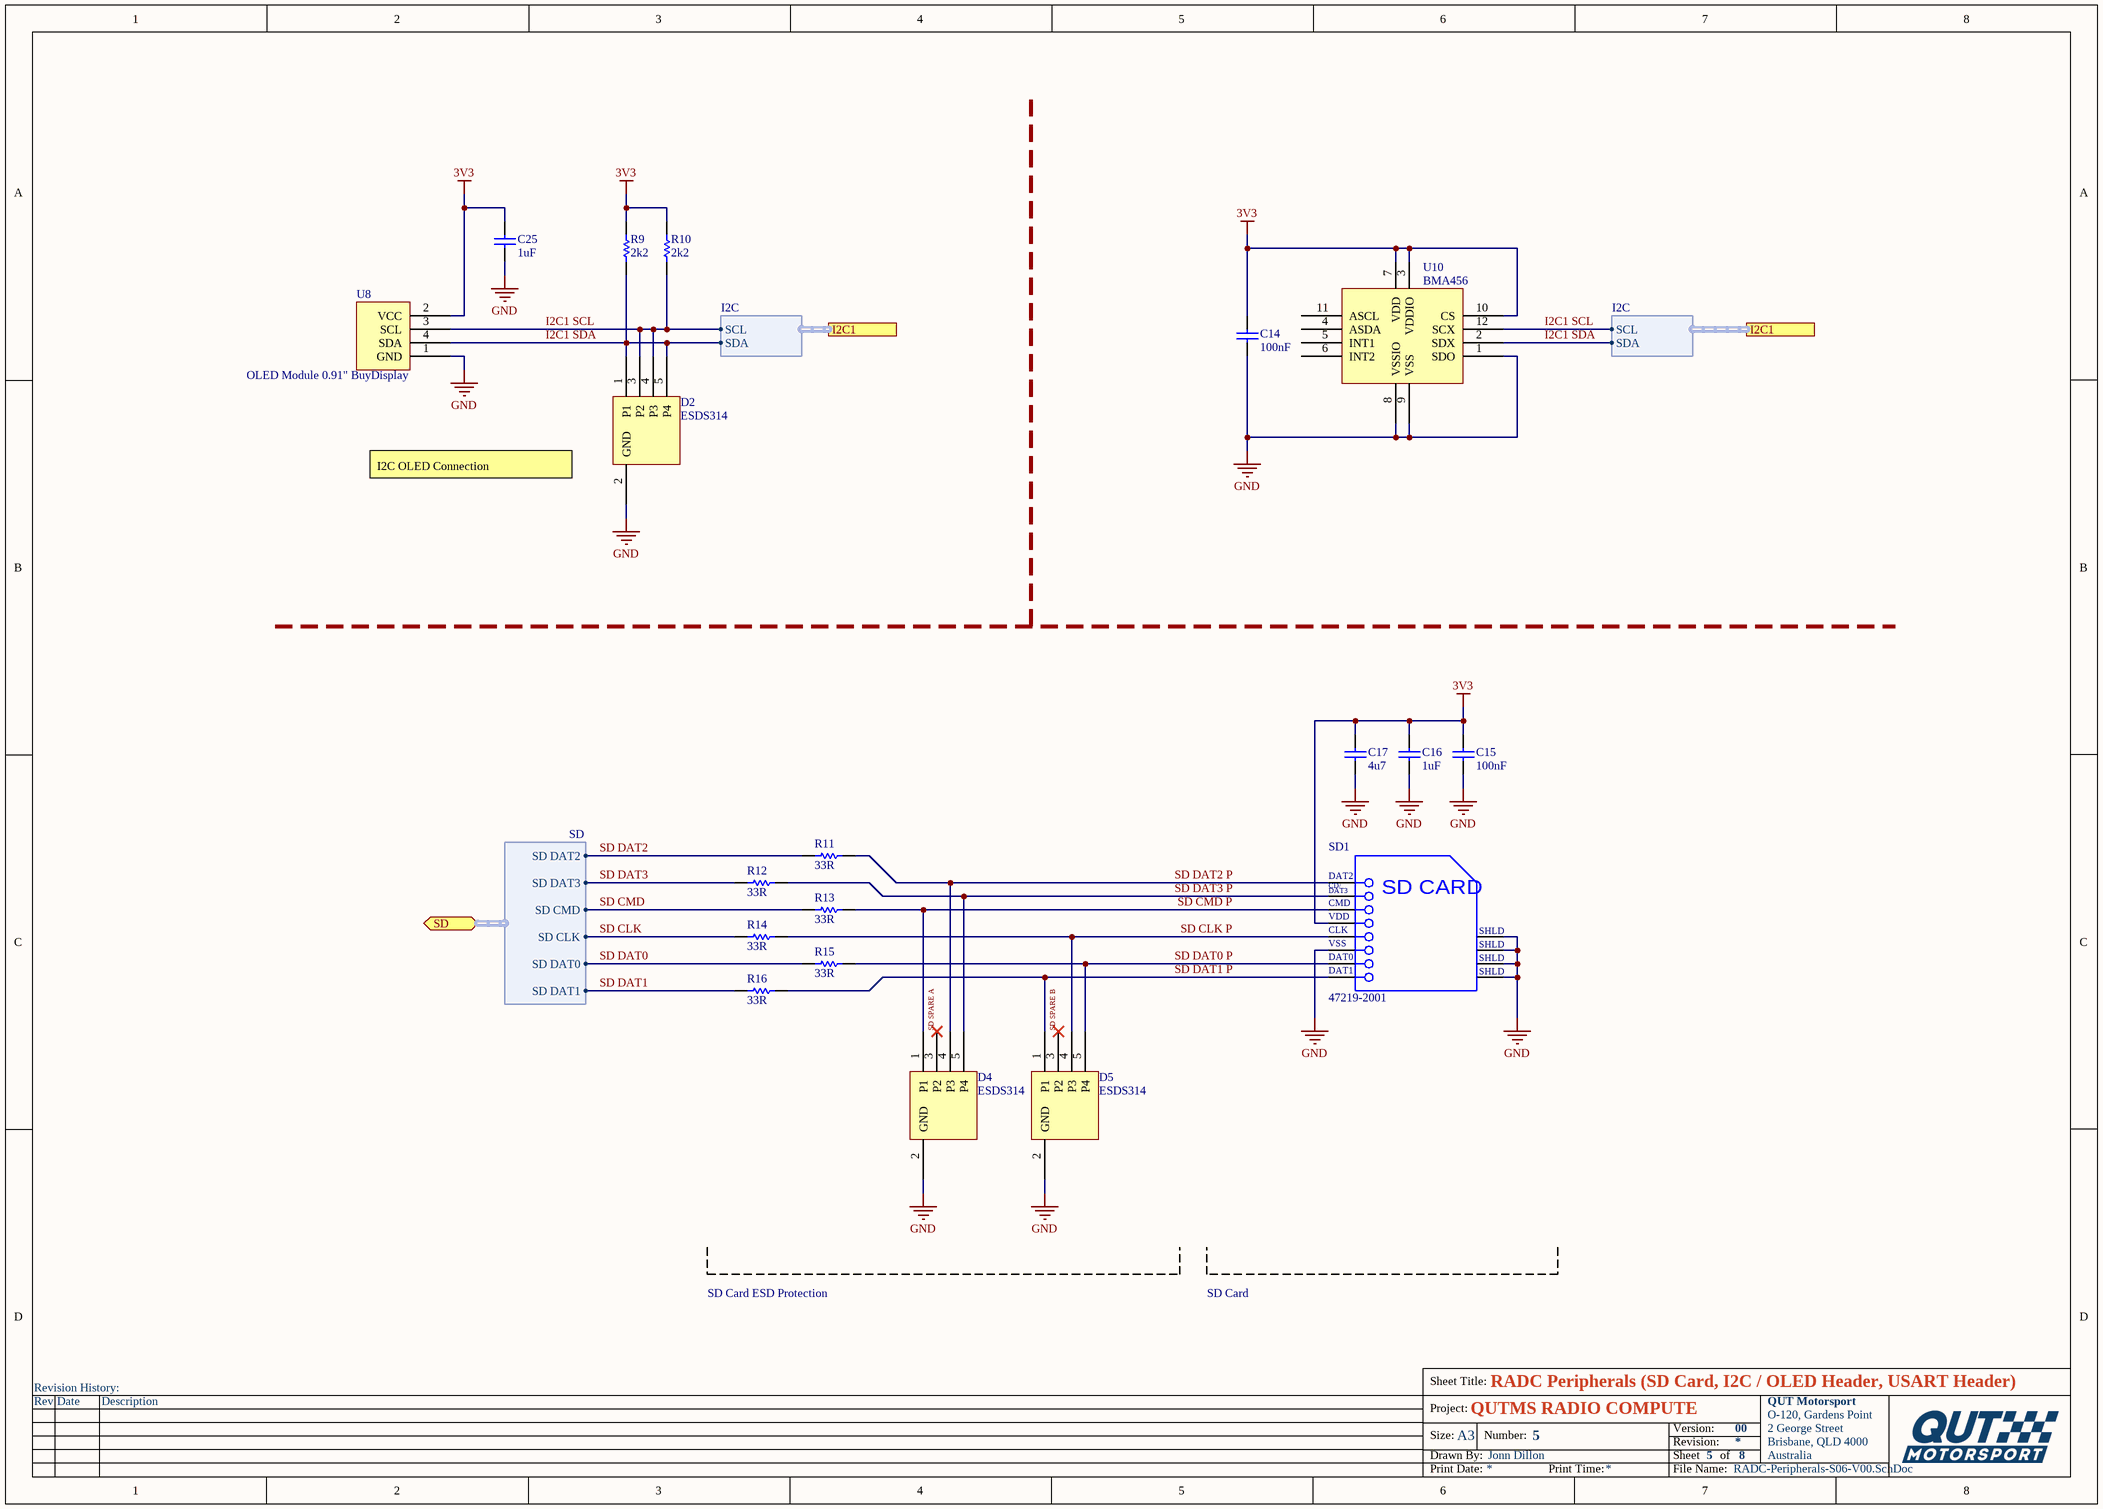
[diagram p4: RADC-Peripherals-S06-V00.SchDoc]

### Parts
C14  100nF  [Cap_Ceramic_0603]
C15  100nF  [Cap_Ceramic_0603]
C16  1uF  [Cap_Ceramic_0603]
C17  4u7  [Cap_Ceramic_0603]
C25  1uF  [Cap_Ceramic_0603]
D2  ESDS314  [SOT-23-5]
D4  ESDS314  [SOT-23-5]
D5  ESDS314  [SOT-23-5]
R9  2k2  [Res_ThinFilm_0603]
R10  2k2  [Res_ThinFilm_0603]
R11  33R  [Res_ThinFilm_0603]
R12  33R  [Res_ThinFilm_0603]
R13  33R  [Res_ThinFilm_0603]
R14  33R  [Res_ThinFilm_0603]
R15  33R  [Res_ThinFilm_0603]
R16  33R  [Res_ThinFilm_0603]
SD1  47219-2001  [47219-2001]
U8  OLED Module 0.91" BuyDisplay  [BuyDisplay 0.91" OLED]
U10  BMA456  [BMA456]

### Ports
I2C1 (harness I2C), SD (bidir, harness SD)

### Harnesses
SD: SD DAT2, SD DAT3, SD CMD, SD CLK, SD DAT0, SD DAT1
I2C: SDA, SCL

### Nets
3V3: C14.2 C15.2 C16.2 C17.2 C25.2 R9.2 R10.2 SD1.4(VDD) U8.2(VCC) U10.3(VDDIO) U10.7(VDD) U10.10(CS)
GND: C14.1 C15.1 C16.1 C17.1 C25.1 D2.2(GND) D4.2(GND) D5.2(GND) SD1.6(VSS) SD1.9(SHLD) SD1.10(SHLD) SD1.11(SHLD) SD1.12(SHLD) U8.1(GND) U10.1(SDO) U10.8(VSSIO) U10.9(VSS)
I2C1 SCL: D2.3(P2) D2.4(P3) R10.1 U8.3(SCL) U10.12(SCX) ; port I2C1.SCL
I2C1 SDA: D2.1(P1) D2.5(P4) R9.1 U8.4(SDA) U10.2(SDX) ; port I2C1.SDA
SD CLK: R14.1 ; port SD.SD CLK
SD CLK P: D5.4(P3) R14.2 SD1.5(CLK)
SD CMD: R13.1 ; port SD.SD CMD
SD CMD P: D4.1(P1) R13.2 SD1.3(CMD)
SD DAT0: R15.1 ; port SD.SD DAT0
SD DAT0 P: D5.5(P4) R15.2 SD1.7(DAT0)
SD DAT1: R16.1 ; port SD.SD DAT1
SD DAT1 P: D5.1(P1) R16.2 SD1.8(DAT1)
SD DAT2: R11.1 ; port SD.SD DAT2
SD DAT2 P: D4.4(P3) R11.2 SD1.1(DAT2)
SD DAT3: R12.1 ; port SD.SD DAT3
SD DAT3 P: D4.5(P4) R12.2 SD1.2(CD/DAT3)
SD SPARE A: D4.3(P2)
SD SPARE B: D5.3(P2)

Not connected (* = marked no-connect by the designer): U10 4(ASDA) 5(INT1) 6(INT2) 11(ASCL)

### Notes on the sheet
- I2C OLED Connection
- SD Card ESD Protection
- SD Card
- Revision History:
- Sheet Title:
- Rev
- Date
- Description
- Project:
- Size:
- Drawn By:
- A3
- Number:
- Revision:
- Sheet
- Version:
- of
- QUT Motorsport
- O-120, Gardens Point
- 2 George Street
- Brisbane, QLD 4000
- Australia
- Print Date:
- Print Time:
- File Name:
- (in symbol 47219-2001) CD/; DAT3; SD CARD

### Library data of the parts
C14 C15 = 100nF 50V 5% X7R 0603: as C20 on sheet RADC-Power-S05-V00
C16 C25 = 1uF 25V 5% X7R 0603: as C1 on sheet RADC-Connectors-S01-V00
C17 = 4u7 50V 5% X7R 0603: as C18 on sheet RADC-Power-S05-V00
D2 D4 D5 = ESDS314: 6.5V (Typ) Clamp 25A (8/20µs) Ipp Tvs Diode Surface Mount SOT-23-5
R9 R10 = 2k2 5% 0603: Resistor, SMD, 2k2, 0.1W, 5%, 0603
R11-R16 = 33R 5% 0603: Resistor, SMD, 33R, 0.1W, 5%, 0603
SD1 = 47219-2001: MicroSD Card Connector, Hinge Type, -40 to 85 degC, 8-Pin SMD, RoHS, Tape and Reel
U8 = OLED Module 0.91" BuyDisplay: I2C Blue 0.91" inch OLED Display Module 128x32 Arduino,Raspberry Pi
U10 = BMA456: Accelerometer X, Y, Z Axis ±2g, 4g, 8g, 16g 1.5kHz ~ 1.6kHz 12-LGA (2x2)

## Sheet RADC-CANBUS-S03-V00.SchDoc: RADC CANBUS (CAN2.0B, ESD Protection, LED Indicators)
size A3; DrawnBy: Jonn Dillon; DocumentNumber: 7; SheetNumber: 7; SheetTotal: 8; Version: 00; Project: QUTMS RADIO COMPUTE; PageSetup: Record=PageOptions|CenterHorizontal=True|CenterVertical=True|PrintScale=0.97|XCorrection=1.00|YCorrection=1.00|PrintKind=0|BorderSize=5000000|LeftOffset=0|BottomOffset=0|Orientation=2|PaperLength=1000|PaperWidth=1000|Scale=100|PaperSource=7|PrintQuality=-4|MediaType=1|DitherType=10|PaperKind=A4|PrintScaleMode=1
Used 2 times, as channels CANBUS, CANBUS. Parts and nets are listed once, with the designators drawn on the sheet.
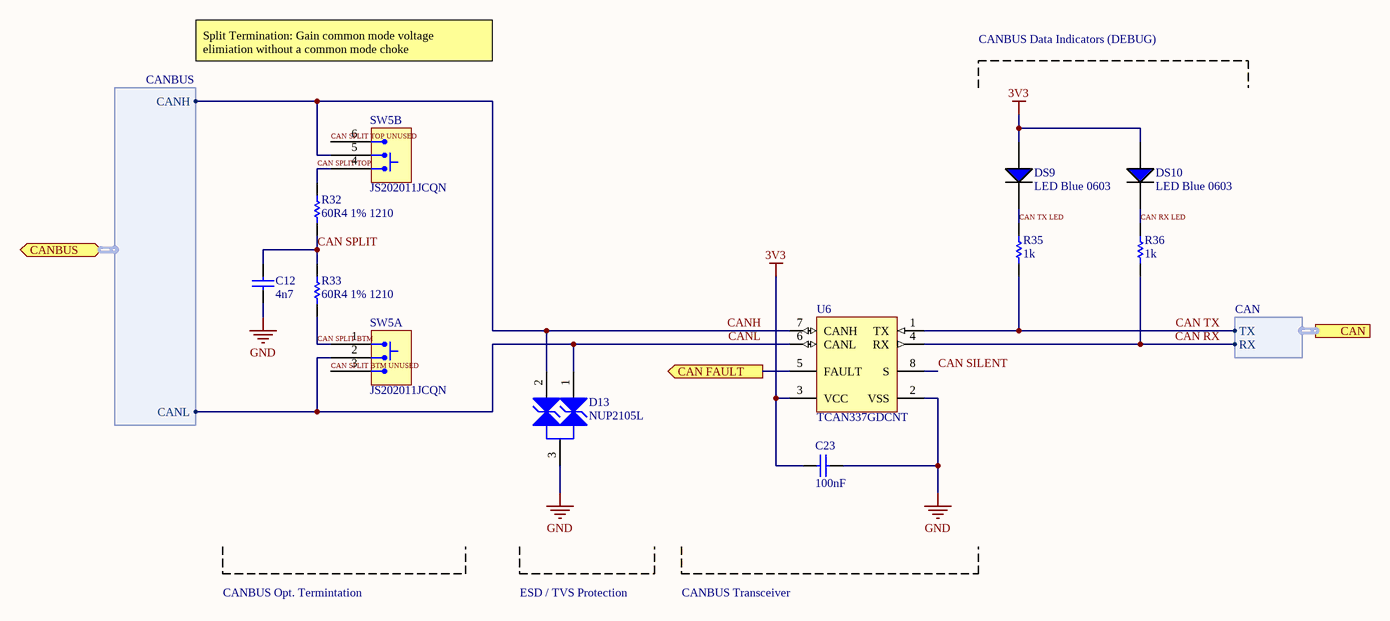
[diagram p5: RADC-CANBUS-S03-V00.SchDoc]

### Parts
C12  4n7  [Cap_Ceramic_0603]
C23  100nF  [Cap_Ceramic_0603]
D13  NUP2105L  [NUP2105L]
DS9  LED Blue 0603  [LED BLUE 0603]
DS10  LED Blue 0603  [LED BLUE 0603]
R32  60R4 1% 1210  [Res_ThinFilm_1210]
R33  60R4 1% 1210  [Res_ThinFilm_1210]
R35  1k  [Res_ThinFilm_0603]
R36  1k  [Res_ThinFilm_0603]
SW5  JS202011JCQN  [JS202011JCQN]  (parts A,B of 2)
U6  TCAN337GDCNT  [SOT-23-8]

### Ports
CAN (harness CAN), CAN FAULT (out), CANBUS (bidir, harness CANBUS)

### Harnesses
CAN: RX, TX
CANBUS: CANH, CANL

### Nets
3V3: C23.1 DS9.1(A) DS10.1(A) U6.3(VCC)
GND: C12.1 C23.2 D13.3 U6.2(VSS)
CAN FAULT: U6.5(FAULT) ; port CAN FAULT
CAN RX: R36.1 U6.4(RX) ; port CAN.RX
CAN RX LED: DS10.2(C) R36.2
CAN SILENT: U6.8(S)
CAN SPLIT: C12.2 R32.1 R33.2
CAN SPLIT BTM: R33.1 SW5.1
CAN SPLIT BTM UNUSED: SW5.3
CAN SPLIT TOP: R32.2 SW5.4
CAN SPLIT TOP UNUSED: SW5.6
CAN TX: R35.1 U6.1(TX) ; port CAN.TX
CAN TX LED: DS9.2(C) R35.2
CANH: D13.2 SW5.5 U6.7(CANH) ; port CANBUS.CANH
CANL: D13.1 SW5.2 U6.6(CANL) ; port CANBUS.CANL

### Channels
CANBUS: designators end in A; ports CAN FAULT=CAN FAULT
CANBUS: designators end in B; ports CAN FAULT=CAN FAULT

### Notes on the sheet
- Split Termination: Gain common mode voltage elimiation without a common mode choke
- CANBUS Data Indicators (DEBUG)
- CANBUS Opt. Termintation
- ESD / TVS Protection
- CANBUS Transceiver
- Revision History:
- Sheet Title:
- Rev
- Date
- Description
- Project:
- Size:
- Drawn By:
- A3
- Number:
- Revision:
- Sheet
- Version:
- of
- QUT Motorsport
- O-120, Gardens Point
- 2 George Street
- Brisbane, QLD 4000
- Australia
- Print Date:
- Print Time:
- File Name:

### Library data of the parts
C12 = 4n7 50V 5% X7R 0603: Capacitor, Ceramic, SMD, 4n7, 50V, 5%, X7R, 0603
C23 = 100nF 50V 5% X7R 0603: as C20 on sheet RADC-Power-S05-V00
R32 R33 = 60R4 1% 1210: Resistor, SMD, 60R4, 0.25W, 1%, 1210
R35 R36 = 1k 5% 0603: Resistor, SMD, 1k, 0.1W, 5%, 0603
SW5 = SLIDE DPDT JS202011JCQN
U6 = TCAN337GDCNT: 1/1 Transceiver CANbus SOT-23-8
D13 = NUP2105L: ComponentLink1Description: Datasheet; ComponentLink1URL: https://www.onsemi.cn/PowerSolutions/document/NUP2105L-D.PDF; Parameter 1: *; ComponentLink2Description: LCSC; ComponentLink2URL: https://lcsc.com/product-detail/TVS_ON-Semiconductor-NUP2105LT1G_C14486.html; ComponentLink3Description: Digikey; ComponentLink3URL: https://www.digikey.com.au/product-detail/en/on-semiconductor/SZNUP2105LT1G/SZNUP2105LT1GOSCT-ND/3487669

## Sheet RADC-ModuleConnect-S07-V00.SchDoc: RADC ModuleConnect (60Pin 0.5mm FFC Connector)
size A3; DrawnBy: Jonn Dillon; DocumentNumber: 4; SheetNumber: 4; SheetTotal: 8; Version: 00; Project: QUTMS RADIO COMPUTE; PageSetup: Record=PageOptions|CenterHorizontal=True|CenterVertical=True|PrintScale=0.97|XCorrection=1.00|YCorrection=1.00|PrintKind=0|BorderSize=5000000|LeftOffset=0|BottomOffset=0|Orientation=2|PaperLength=1000|PaperWidth=1000|Scale=100|PaperSource=7|PrintQuality=-4|MediaType=1|DitherType=10|PaperKind=A4|PrintScaleMode=1
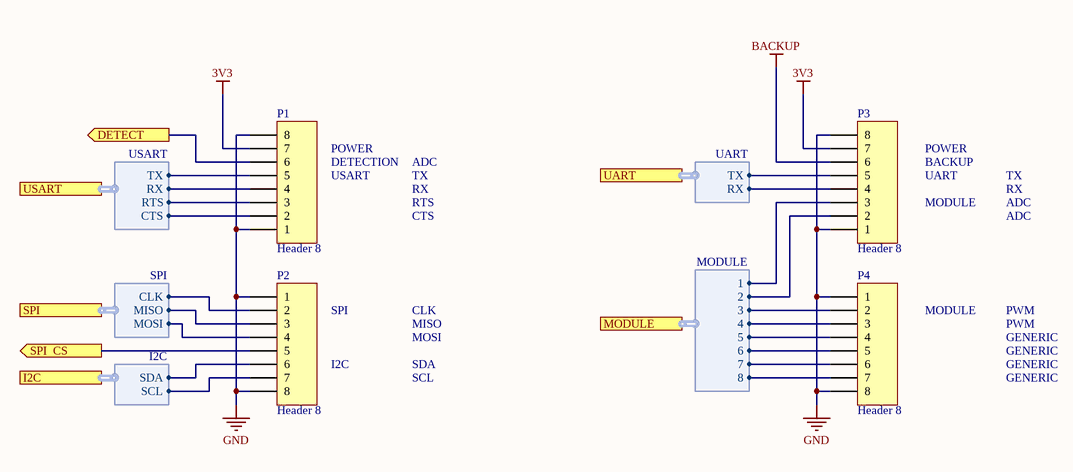
[diagram p6: RADC-ModuleConnect-S07-V00.SchDoc]

### Parts
P1  Header 8  [HDR1X8]
P2  Header 8  [HDR1X8]
P3  Header 8  [HDR1X8]
P4  Header 8  [HDR1X8]

### Ports
DETECT (out), I2C (harness I2C), MODULE (harness MODULE), SPI  CS (out), SPI (harness SPI), UART (harness UART), USART (harness USART)

### Harnesses
SPI: MISO, MOSI, CLK
UART: TX, RX
I2C: SDA, SCL
MODULE: 1, 2, 3, 4, 5, 6, 7, 8
USART: TX, RX, RTS, CTS

### Nets
3V3: P1.7 P3.7
BACKUP: P3.6
GND: P1.1 P1.8 P2.1 P2.8 P3.1 P3.8 P4.1 P4.8
DETECT: P1.6 ; port DETECT
I2C2 SCL: P2.7 ; port I2C.SCL
I2C2 SDA: P2.6 ; port I2C.SDA
MODULE 1: P3.3 ; port MODULE.1
MODULE 3: P4.2 ; port MODULE.3
MODULE 4: P4.3 ; port MODULE.4
MODULE 5: P4.4 ; port MODULE.5
MODULE 6: P4.5 ; port MODULE.6
MODULE 7: P4.6 ; port MODULE.7
MODULE 8: P4.7 ; port MODULE.8
MOUDLE 2: P3.2 ; port MODULE.2
SPI1 MISO: P2.3 ; port SPI.MISO
SPI1 MOSI: P2.4 ; port SPI.MOSI
SPI1 SCK: P2.2 ; port SPI.CLK
SPI CS: P2.5 ; port SPI  CS
USART2 CTS: P1.2 ; port USART.CTS
USART2 RTS: P1.3 ; port USART.RTS
USART2 RX: P1.4 ; port USART.RX
USART2 TX: P1.5 ; port USART.TX
USART3 RX: P3.4 ; port UART.RX
USART3 TX: P3.5 ; port UART.TX

### Notes on the sheet
- DETECTION
- USART
- POWER
- ADC
- TX
- RX
- BACKUP
- UART
- RTS
- CTS
- MODULE
- SPI
- CLK
- MISO
- PWM
- I2C
- SDA
- SCL
- MOSI
- GENERIC
- Revision History:
- Sheet Title:
- Rev
- Date
- Description
- Project:
- Size:
- Drawn By:
- A3
- Number:
- Revision:
- Sheet
- Version:
- of
- QUT Motorsport
- O-120, Gardens Point
- 2 George Street
- Brisbane, QLD 4000
- Australia
- Print Date:
- Print Time:
- File Name:

### Library data of the parts
P1-P4 = Header 8: Header, 8-Pin; LatestRevisionDate: 17-Jul-2002; LatestRevisionNote: Re-released for DXP Platform.; Publisher: Altium Limited

## Sheet RADC-RS485-S04-V00.SchDoc
size A3; SheetNumber: 8; SheetTotal: 8
Used 2 times, as channels RS485, RS485. Parts and nets are listed once, with the designators drawn on the sheet.
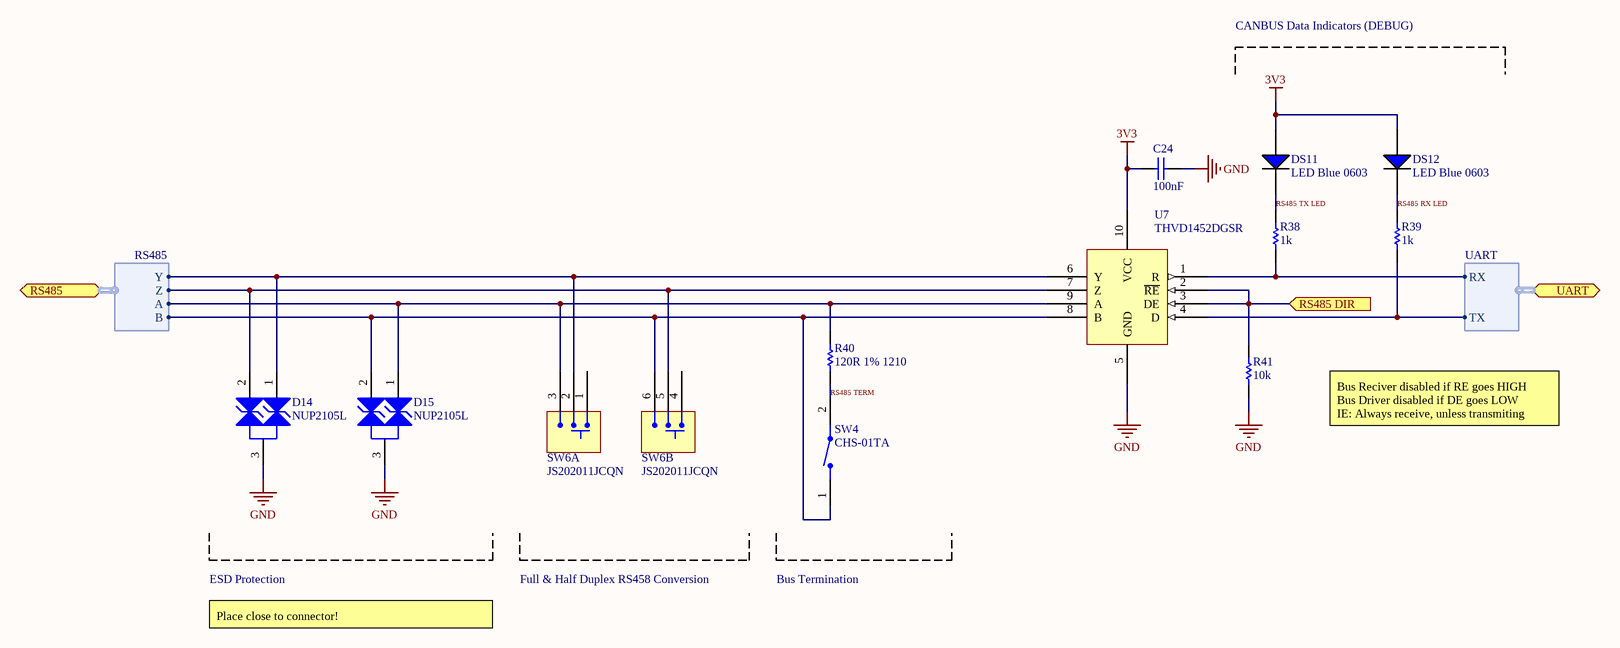
[diagram p7: RADC-RS485-S04-V00.SchDoc]

### Parts
C24  100nF  [Cap_Ceramic_0603]
D14  NUP2105L  [NUP2105L]
D15  NUP2105L  [NUP2105L]
DS11  LED Blue 0603  [LED BLUE 0603]
DS12  LED Blue 0603  [LED BLUE 0603]
R38  1k  [Res_ThinFilm_0603]
R39  1k  [Res_ThinFilm_0603]
R40  120R 1% 1210  [Res_ThinFilm_1210]
R41  10k  [Res_ThinFilm_0603]
SW4  CHS-01TA  [CHS-01TA]
SW6  JS202011JCQN  [JS202011JCQN]  (parts A,B of 2)
U7  THVD1452DGSR  [10-VSSOP]

### Ports
RS485 (bidir, harness RS485), RS485 DIR (in), UART (bidir, harness UART)

### Harnesses
RS485: Y, Z, A, B
UART: TX, RX

### Nets
3V3: C24.1 DS11.1(A) DS12.1(A) U7.10(VCC)
GND: C24.2 D14.3 D15.3 R41.1 U7.5(GND)
RS485 DIR: R41.2 U7.2(~{RE}) U7.3(DE) ; port RS485 DIR
RS485 RX LED: DS12.2(C) R39.2
RS485 TERM: R40.1 SW4.2
RS485 TX LED: DS11.2(C) R38.2
NetD14_1: D14.1 SW6.2 U7.6(Y) ; port RS485.Y
NetD14_2: D14.2 SW6.5 U7.7(Z) ; port RS485.Z
NetD15_1: D15.1 R40.2 SW6.3 U7.9(A) ; port RS485.A
NetD15_2: D15.2 SW4.1 SW6.6 U7.8(B) ; port RS485.B
NetR38_1: R38.1 U7.1(R) ; port UART.RX
NetR39_1: R39.1 U7.4(D) ; port UART.TX

Not connected (* = marked no-connect by the designer): SW6 1 4

### Channels
RS485: designators end in A; ports RS485 DIR=RS485A DIR
RS485: designators end in B; ports RS485 DIR=RS485B DIR

### Notes on the sheet
- CANBUS Data Indicators (DEBUG)
- Bus Reciver disabled if RE goes HIGH
  Bus Driver disabled if DE goes LOW
  IE: Always receive, unless transmiting
- ESD Protection
- Place close to connector!
- Full & Half Duplex RS458 Conversion
- Bus Termination
- Revision History:
- Sheet Title:
- Rev
- Date
- Description
- Project:
- Size:
- Drawn By:
- A3
- Number:
- Revision:
- Sheet
- Version:
- of
- QUT Motorsport
- O-120, Gardens Point
- 2 George Street
- Brisbane, QLD 4000
- Australia
- Print Date:
- Print Time:
- File Name:

### Library data of the parts
C24 = 100nF 50V 5% X7R 0603: as C20 on sheet RADC-Power-S05-V00
R38 R39 = 1k 5% 0603: Resistor, SMD, 1k, 0.1W, 5%, 0603
R40 = 120R 1% 1210: Resistor, SMD, 120R, 0.25W, 1%, 1210
R41 = 10k 5% 0603: Resistor, SMD, 10k, 0.1W, 5%, 0603
SW4 = CHS-01TA: Dip Switch SPST 1 Position Surface Mount Slide (Standard) Actuator 100mA 6VDC
SW6 = SLIDE DPDT JS202011JCQN
U7 = THVD1452DGSR: 1/1 Transceiver Full RS485 10-VSSOP
D14 D15 = NUP2105L: ComponentLink1Description: Datasheet; ComponentLink1URL: https://www.onsemi.cn/PowerSolutions/document/NUP2105L-D.PDF; ComponentLink2Description: LCSC; ComponentLink2URL: https://lcsc.com/product-detail/TVS_ON-Semiconductor-NUP2105LT1G_C14486.html; ComponentLink3Description: Digikey; ComponentLink3URL: https://www.digikey.com.au/product-detail/en/on-semiconductor/SZNUP2105LT1G/SZNUP2105LT1GOSCT-ND/3487669

## Nets that join several sheets
3V3: RADC-Power-S05-V00 (6 pins), RADC-Microcontroller-S02-V00 (22 pins), RADC-Peripherals-S06-V00 (12 pins), CANBUS (C23A.1 DS9A.1 DS10A.1 U6A.3), CANBUS (C23B.1 DS9B.1 DS10B.1 U6B.3), RADC-ModuleConnect-S07-V00 (P1.7 P3.7), RS485 (C24A.1 DS11A.1 DS12A.1 U7A.10), RS485 (C24B.1 DS11B.1 DS12B.1 U7B.10)
12V: RADC-Connectors-S01-V00 (10 pins), RADC-Power-S05-V00 (9 pins)
BACKUP: RADC-Power-S05-V00 (CS1.A D6.K), RADC-ModuleConnect-S07-V00 (P3.6)
GND: RADC-Connectors-S01-V00 (23 pins), RADC-Power-S05-V00 (22 pins), RADC-Microcontroller-S02-V00 (29 pins), RADC-Peripherals-S06-V00 (17 pins), CANBUS (C12A.1 C23A.2 D13A.3 U6A.2), CANBUS (C12B.1 C23B.2 D13B.3 U6B.2), RADC-ModuleConnect-S07-V00 (8 pins), RS485 (5 pins), RS485 (5 pins)
RTC: RADC-Power-S05-V00 (BAT1.1), RADC-Microcontroller-S02-V00 (U1.1)
VUSB: RADC-Connectors-S01-V00 (7 pins), RADC-Power-S05-V00 (F1.1 R29.2)
CAN1_N: RADC-Connectors-S01-V00 (J2.1 J3.1 SW2.4), CANBUS (D13A.1 SW5A.2 U6A.6)
CAN1_P: RADC-Connectors-S01-V00 (J2.2 J3.2 SW2.1), CANBUS (D13A.2 SW5A.5 U6A.7)
CAN2_N: RADC-Connectors-S01-V00 (J2.7 J3.7 SW2.5), CANBUS (D13B.1 SW5B.2 U6B.6)
CAN2_P: RADC-Connectors-S01-V00 (J2.8 J3.8 SW2.2), CANBUS (D13B.2 SW5B.5 U6B.7)
CAN FAULT: RADC-Microcontroller-S02-V00 (R1.1 U9.2), CANBUS (U6A.5), CANBUS (U6B.5)
CAN RX: RADC-Microcontroller-S02-V00 (U1.33), CANBUS (R36B.1 U6B.4)
CAN RX: RADC-Microcontroller-S02-V00 (U1.61), CANBUS (R36A.1 U6A.4)
CAN TX: RADC-Microcontroller-S02-V00 (U1.34), CANBUS (R35B.1 U6B.1)
CAN TX: RADC-Microcontroller-S02-V00 (U1.62), CANBUS (R35A.1 U6A.1)
DETECT: RADC-Microcontroller-S02-V00 (U1.9), RADC-ModuleConnect-S07-V00 (P1.6)
I2C1 SCL: RADC-Microcontroller-S02-V00 (U1.58), RADC-Peripherals-S06-V00 (5 pins)
I2C1 SDA: RADC-Microcontroller-S02-V00 (U1.59), RADC-Peripherals-S06-V00 (5 pins)
I2C2 SCL: RADC-Microcontroller-S02-V00 (R42.1 U1.29), RADC-ModuleConnect-S07-V00 (P2.7)
I2C2 SDA: RADC-Microcontroller-S02-V00 (R43.1 U1.53), RADC-ModuleConnect-S07-V00 (P2.6)
MODULE 1: RADC-Microcontroller-S02-V00 (U1.10), RADC-ModuleConnect-S07-V00 (P3.3)
MODULE 3: RADC-Microcontroller-S02-V00 (U1.35), RADC-ModuleConnect-S07-V00 (P4.2)
MODULE 4: RADC-Microcontroller-S02-V00 (U1.36), RADC-ModuleConnect-S07-V00 (P4.3)
MODULE 5: RADC-Microcontroller-S02-V00 (U1.20), RADC-ModuleConnect-S07-V00 (P4.4)
MODULE 6: RADC-Microcontroller-S02-V00 (U1.24), RADC-ModuleConnect-S07-V00 (P4.5)
MODULE 7: RADC-Microcontroller-S02-V00 (U1.26), RADC-ModuleConnect-S07-V00 (P4.6)
MODULE 8: RADC-Microcontroller-S02-V00 (U1.41), RADC-ModuleConnect-S07-V00 (P4.7)
MOUDLE 2: RADC-Microcontroller-S02-V00 (U1.11), RADC-ModuleConnect-S07-V00 (P3.2)
RS485A A: RADC-Connectors-S01-V00 (J1.3), RS485 (D15A.1 R40A.2 SW6A.3 U7A.9)
RS485A B: RADC-Connectors-S01-V00 (J1.4), RS485 (D15A.2 SW4A.1 SW6A.6 U7A.8)
RS485A DIR: RADC-Microcontroller-S02-V00 (U1.50), RS485 (R41A.2 U7A.2 U7A.3)
RS485A Y: RADC-Connectors-S01-V00 (J1.1), RS485 (D14A.1 SW6A.2 U7A.6)
RS485A Z: RADC-Connectors-S01-V00 (J1.2), RS485 (D14A.2 SW6A.5 U7A.7)
RS485B A: RADC-Connectors-S01-V00 (J1.9), RS485 (D15B.1 R40B.2 SW6B.3 U7B.9)
RS485B B: RADC-Connectors-S01-V00 (J1.10), RS485 (D15B.2 SW4B.1 SW6B.6 U7B.8)
RS485B DIR: RADC-Microcontroller-S02-V00 (U1.55), RS485 (R41B.2 U7B.2 U7B.3)
RS485B Y: RADC-Connectors-S01-V00 (J1.7), RS485 (D14B.1 SW6B.2 U7B.6)
RS485B Z: RADC-Connectors-S01-V00 (J1.8), RS485 (D14B.2 SW6B.5 U7B.7)
SD CLK: RADC-Microcontroller-S02-V00 (U1.28), RADC-Peripherals-S06-V00 (R14.1)
SD CMD: RADC-Microcontroller-S02-V00 (U1.54), RADC-Peripherals-S06-V00 (R13.1)
SD DAT0: RADC-Microcontroller-S02-V00 (U1.39), RADC-Peripherals-S06-V00 (R15.1)
SD DAT1: RADC-Microcontroller-S02-V00 (U1.40), RADC-Peripherals-S06-V00 (R16.1)
SD DAT2: RADC-Microcontroller-S02-V00 (U1.27), RADC-Peripherals-S06-V00 (R11.1)
SD DAT3: RADC-Microcontroller-S02-V00 (U1.52), RADC-Peripherals-S06-V00 (R12.1)
SPI1 MISO: RADC-Microcontroller-S02-V00 (U1.22), RADC-ModuleConnect-S07-V00 (P2.3)
SPI1 MOSI: RADC-Microcontroller-S02-V00 (U1.23), RADC-ModuleConnect-S07-V00 (P2.4)
SPI1 SCK: RADC-Microcontroller-S02-V00 (U1.21), RADC-ModuleConnect-S07-V00 (P2.2)
SPI CS: RADC-Microcontroller-S02-V00 (U1.2), RADC-ModuleConnect-S07-V00 (P2.5)
USART1 RX: RADC-Microcontroller-S02-V00 (U1.43), RS485 (R38A.1 U7A.1)
USART1 TX: RADC-Microcontroller-S02-V00 (U1.42), RS485 (R39A.1 U7A.4)
USART2 CTS: RADC-Microcontroller-S02-V00 (U1.14), RADC-ModuleConnect-S07-V00 (P1.2)
USART2 RTS: RADC-Microcontroller-S02-V00 (U1.15), RADC-ModuleConnect-S07-V00 (P1.3)
USART2 RX: RADC-Microcontroller-S02-V00 (U1.17), RADC-ModuleConnect-S07-V00 (P1.4)
USART2 TX: RADC-Microcontroller-S02-V00 (U1.16), RADC-ModuleConnect-S07-V00 (P1.5)
USART3 RX: RADC-Microcontroller-S02-V00 (U1.25), RADC-ModuleConnect-S07-V00 (P3.4)
USART3 TX: RADC-Microcontroller-S02-V00 (U1.51), RADC-ModuleConnect-S07-V00 (P3.5)
USART6 RX: RADC-Microcontroller-S02-V00 (U1.38), RS485 (R38B.1 U7B.1)
USART6 TX: RADC-Microcontroller-S02-V00 (U1.37), RS485 (R39B.1 U7B.4)
USB D_N: RADC-Connectors-S01-V00 (5 pins), RADC-Microcontroller-S02-V00 (U1.44)
USB D_P: RADC-Connectors-S01-V00 (5 pins), RADC-Microcontroller-S02-V00 (U1.45)